# Altium project AutoLidar_VIP_Spring25.PrjPcb (part 1 of 2)
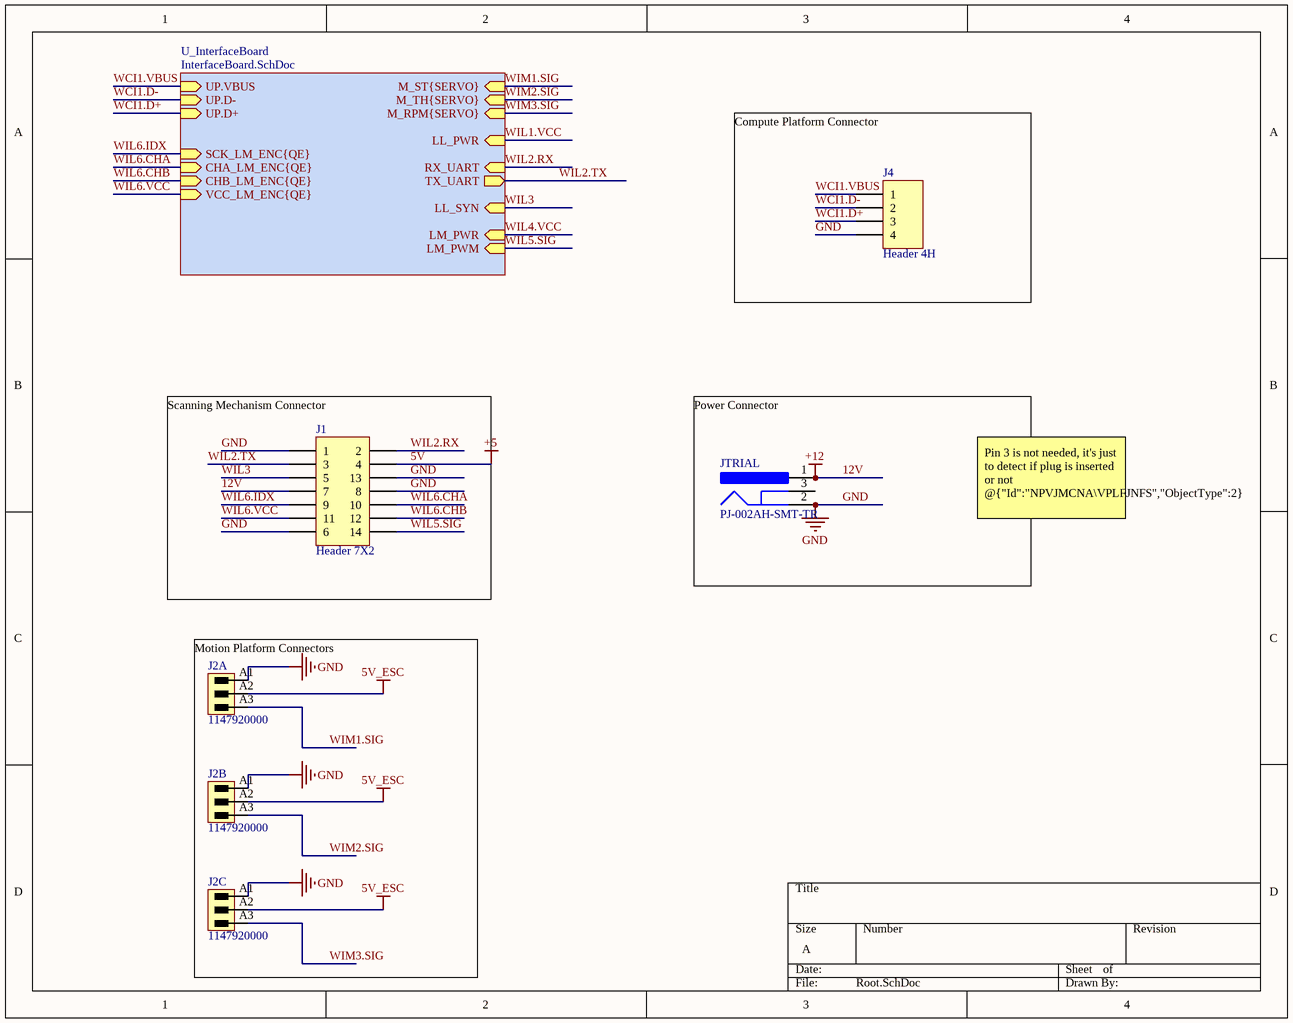
[diagram p0: Root.SchDoc]
11 sheets, 122 parts. Net scope: hierarchical (ports join the sheet entries above them; power ports are global).
Board files: smallerBoardDR1.PcbDoc, PCB1.PcbDoc, draft2.PcbDoc
Sheets:
  Scanning Mechanism.SchDoc
  Power Supply.SchDoc
  Root.SchDoc
    U_InterfaceBoard = InterfaceBoard.SchDoc
      Designator = Manual Override.SchDoc
      Designator = BNO055.SchDoc
      U_5ch Receiver = 5ch Receiver.SchDoc
      U_L Subsys1 = L Subsys1.SchDoc
      U_MSub = MSub.SchDoc
      Designator = USB HUB.SchDoc
      5V Regulator = 5V Regulator.SchDoc

## Sheet Scanning Mechanism.SchDoc
size A; SheetNumber: 6; SheetTotal: 6

## Sheet Power Supply.SchDoc
size A; SheetNumber: 3; SheetTotal: 3

## Sheet Root.SchDoc
size A; SheetNumber: 3; SheetTotal: 11

### Parts
J1  Header 7X2  [HDR2X7]
J2A  1147920000  [SL_5_08HC_180LF_03]
J2B  1147920000  [SL_5_08HC_180LF_03]
J2C  1147920000  [SL_5_08HC_180LF_03]
J4  Header 4H  [HDR1X4H]
JTRIAL  PJ-002AH-SMT-TR  [CUI-PJ-002AH-4_V]

### Sub-sheets
U_InterfaceBoard = InterfaceBoard.SchDoc: M_RPM{SERVO} (in), M_ST{SERVO} (in), M_TH{SERVO} (in), SCK_LM_ENC{QE} (in), CHB_LM_ENC{QE} (in), CHA_LM_ENC{QE} (in), VCC_LM_ENC{QE} (in), LM_PWM (in), RX_UART (in), TX_UART (out), LL_SYN (in), LL_PWR (in), LM_PWR (in), UP.VBUS (in), UP.D+ (in), UP.D- (in)

### Nets
5V: J1.4  [also labelled +5]
5V_ESC: J2A.A2 J2B.A2 J2C.A2
12V: J1.7 JTRIAL.1  [also labelled +12]
GND: J1.1 J1.6 J1.8 J1.13 J2A.A1 J2B.A1 J2C.A1 J4.4 JTRIAL.2
WCI1.D+: J4.3 ; sheet U_InterfaceBoard/UP.D+  [project net UP.D+]
WCI1.D-: J4.2 ; sheet U_InterfaceBoard/UP.D-  [project net UP.D-]
WCI1.VBUS: J4.1 ; sheet U_InterfaceBoard/UP.VBUS  [project net UP.VBUS]
WIL1.VCC: sheet U_InterfaceBoard/LL_PWR
WIL2.RX: J1.2 ; sheet U_InterfaceBoard/RX_UART
WIL2.TX: J1.3 ; sheet U_InterfaceBoard/TX_UART
WIL3: J1.5 ; sheet U_InterfaceBoard/LL_SYN
WIL4.VCC: sheet U_InterfaceBoard/LM_PWR
WIL5.SIG: J1.14 ; sheet U_InterfaceBoard/LM_PWM
WIL6.CHA: J1.10 ; sheet U_InterfaceBoard/CHA_LM_ENC{QE}
WIL6.CHB: J1.12 ; sheet U_InterfaceBoard/CHB_LM_ENC{QE}
WIL6.IDX: J1.9 ; sheet U_InterfaceBoard/SCK_LM_ENC{QE}
WIL6.VCC: J1.11 ; sheet U_InterfaceBoard/VCC_LM_ENC{QE}  [project net DN1.VBUS]
WIM1.SIG: J2A.A3 ; sheet U_InterfaceBoard/M_ST{SERVO}  [project net IM2Y.SIG]
WIM2.SIG: J2B.A3 ; sheet U_InterfaceBoard/M_TH{SERVO}  [project net IM1Y.SIG]
WIM3.SIG: J2C.A3 ; sheet U_InterfaceBoard/M_RPM{SERVO}  [project net DN2.VBUS]

Not connected (* = marked no-connect by the designer): JTRIAL 3

### Notes on the sheet
- (near J4) Compute Platform Connector
- Pin numbering on footprint does not match old design. To minimize confusion we probably should change this at some point @{"Id":"NPVJMCNA\MLTVRLOO","ObjectType":2}
- Pin 3 is not needed, it's just to detect if plug is inserted or not @{"Id":"NPVJMCNA\VPLFJNFS","ObjectType":2}
- (near J1) Scanning Mechanism Connector
- (near JTRIAL) Power Connector
- Motion Platform Connectors

### Library data of the parts
J1 = CMP-002-00362-2: Header, 7-Pin, Dual row; Signal Integrity: Connector; Publisher: Altium Limited; LatestRevisionDate: 17-Jul-2002; LatestRevisionNote: Re-released for DXP Platform.; Component Type: Standard; Source: Miscellaneous Connectors.SchLib; Pins: 14; Design Item ID: Header 7X2
J2A J2B J2C = CMP-1559-01007-1: OMNIMATE Signal - series BL/SL 5.08; Manufacturer: Weidmueller; Contact_surface: tinned; Outgoing_elbow: 180°; Rated_voltage_use_group_B_UL_1059: 300 V; Insulating_material: PA GF; Solder_pin_length_mm: 3.2 mm; Rated_voltage_for_surge_voltage_class_pollution_degree_II_2: 400 V; Side_termination_characteristic: Solder flange; Pitch_mm: 5.08 mm; No_of_poles: 3; Rated_current_use_group_B_UL_1059: 16 A; Short_text_for_material: SL 5.08HC/03/180LF 3.2SN OR BX; Pitch_inch: 0.2 inch; Contact_material: Cu-Leg; UL_94_flammability_rating: V-0; Mounting_onto_the_PCB: Solder connection; Packaging: Box; ComponentLink1URL: http://www.weidmueller.com/; Colour: Orange; PackageReference: SL_5_08HC_180LF_03; Qty: 100 PCS; ComponentLink1Description: Manufacturer URL; Revision: V1; ComponentLink2Description: URL Link1; ComponentLink2URL: http://catalog.weidmueller.com/catalog/Start.do?localeId=en&ObjectID=1147920000; PartNumber: 1147920000
J4 = Header 4H: Header, 4-Pin, Right Angle; LatestRevisionDate: 17-Jul-2002; LatestRevisionNote: Re-released for DXP Platform.; Publisher: Altium Limited
JTRIAL = CMP-2000-06896-2: DC Power Jack, Right Angle, -25 to 85 degC, 4-Pin 14.8 x 9 x 11 mm SMD, RoHS, Tape and Reel; Manufacturer: CUIInc.; Brand: CUI; Inside Contact Diameter: 2mm; Voltage Rating: 24V; Insulation Resistance: 100MOhms; Outside Contact Diameter: 6.5mm; Current Rating: 5A; Mounting Angle: Right; Contact Plating: Nickel; Package Description: 4-Pin Surface Mount Device, Body 14.8 x 9 mm, Pitch 6.1 mm; Factory Pack Quantity: 350; Datasheet Version: Rev. 1.03, 11/2012; Operating Temperature Range: -25Cto+85C; Termination Style: SMD/SMT; Product: Jacks; Contact Gender: Male; Product Category: DCPowerConnectors; RoHS: True; Connector Type: DCPowerJack; Packaging: Reel; Contact Material: Brass; Flammability Rating: UL94V-0; Datasheet URL: http://www.cui.com/product/resource/pj-002ah-smt.pdf; Package Reference: PJ-002AH; Manufacturer URL: http://www.cui.com/; PartNumber: PJ-002AH; Mounting Style: SMD/SMT; Mounting Technology: SurfaceMount; Housing Material: Polyamide(PA)

## Sheet InterfaceBoard.SchDoc
size B; SheetNumber: 4; SheetTotal: 11
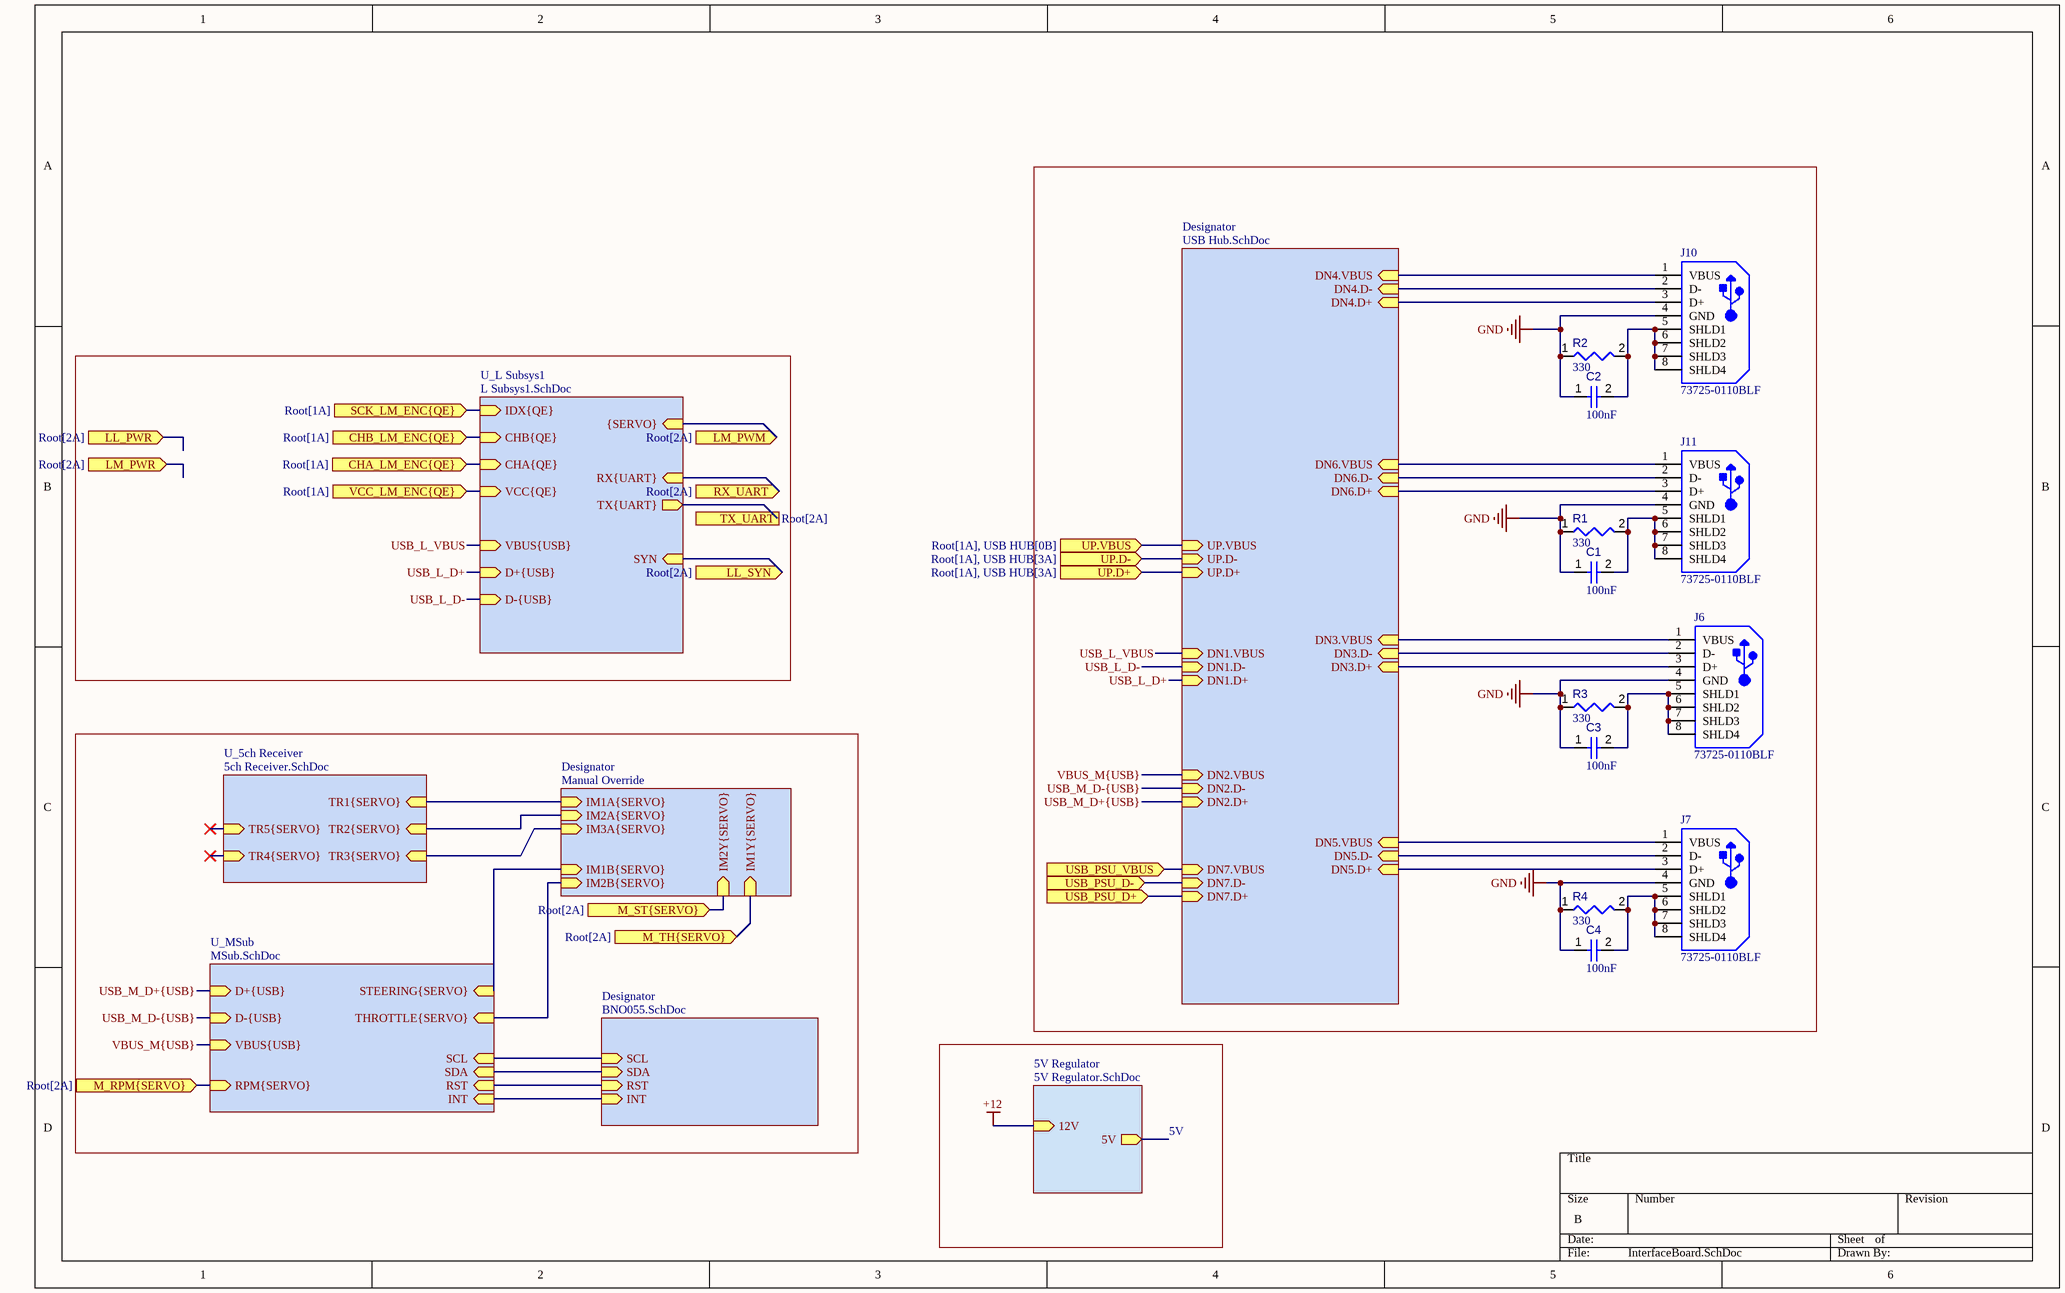
[diagram p1: InterfaceBoard.SchDoc]

### Parts
C1  value 100nF  [CAPC1005X56X25LL10T15]  (hidden comment: Capacitor 0.1 uF +/- 5% 16 V 0402)
C2  value 100nF  [CAPC1005X56X25LL10T15]  (hidden comment: Capacitor 0.1 uF +/- 5% 16 V 0402)
C3  value 100nF  [CAPC1005X56X25LL10T15]  (hidden comment: Capacitor 0.1 uF +/- 5% 16 V 0402)
C4  value 100nF  [CAPC1005X56X25LL10T15]  (hidden comment: Capacitor 0.1 uF +/- 5% 16 V 0402)
J6  73725-0110BLF  [FCI-73725-0110BLF_V]
J7  73725-0110BLF  [FCI-73725-0110BLF_V]
J10  73725-0110BLF  [FCI-73725-0110BLF_V]
J11  73725-0110BLF  [FCI-73725-0110BLF_V]
R1  value 330  [RESC0402(1005)_L]  (hidden comment: Resistor 330R +/-5 % 0402 63 mW)
R2  value 330  [RESC0402(1005)_L]  (hidden comment: Resistor 330R +/-5 % 0402 63 mW)
R3  value 330  [RESC0402(1005)_L]  (hidden comment: Resistor 330R +/-5 % 0402 63 mW)
R4  value 330  [RESC0402(1005)_L]  (hidden comment: Resistor 330R +/-5 % 0402 63 mW)

### Sub-sheets
5V Regulator = 5V Regulator.SchDoc: 12V (in), 5V (out)
Designator = Manual Override: IM1A{SERVO} (in), IM2A{SERVO} (in), IM3A{SERVO} (in), IM1B{SERVO} (in), IM2B{SERVO} (in), IM1Y{SERVO} (in), IM2Y{SERVO} (in)
Designator = BNO055.SchDoc: RST (in), SDA (in), INT (in), SCL (in)
Designator = USB Hub.SchDoc: DN4.VBUS (in), DN4.D- (in), DN4.D+ (in), DN6.VBUS (in), DN6.D- (in), DN6.D+ (in), DN3.VBUS (in), DN3.D- (in), DN3.D+ (in), DN5.VBUS (in), DN5.D- (in), DN5.D+ (in), DN7.D+ (in), DN7.D- (in), DN7.VBUS (in), DN2.D+ (in), DN2.D- (in), DN2.VBUS (in), DN1.D+ (in), DN1.D- (in), DN1.VBUS (in), UP.VBUS (in), UP.D+ (in), UP.D- (in)
U_5ch Receiver = 5ch Receiver.SchDoc: TR2{SERVO} (in), TR5{SERVO} (in), TR3{SERVO} (in), TR1{SERVO} (in), TR4{SERVO} (in)
U_L Subsys1 = L Subsys1.SchDoc: IDX{QE} (in), CHB{QE} (in), CHA{QE} (in), VCC{QE} (in), VBUS{USB} (in), D+{USB} (in), D-{USB} (in), {SERVO} (in), RX{UART} (in), TX{UART} (out), SYN (in)
U_MSub = MSub.SchDoc: D+{USB} (in), RPM{SERVO} (in), STEERING{SERVO} (in), THROTTLE{SERVO} (in), SDA (in), INT (in), RST (in), SCL (in), D-{USB} (in), VBUS{USB} (in)

### Ports
CHA_LM_ENC{QE} (in, see Root[1A]), CHB_LM_ENC{QE} (in, see Root[1A]), LL_PWR (in, see Root[2A]), LL_SYN (in, see Root[2A]), LM_PWM (in, see Root[2A]), LM_PWR (in, see Root[2A]), M_RPM{SERVO} (in, see Root[2A]), M_ST{SERVO} (in, see Root[2A]), M_TH{SERVO} (in, see Root[2A]), RX_UART (in, see Root[2A]), SCK_LM_ENC{QE} (in, see Root[1A]), TX_UART (out, see Root[2A]), UP.D+ (in, see Root[1A], USB HUB[3A]), UP.D- (in, see Root[1A], USB HUB[3A]), UP.VBUS (in, see Root[1A], USB HUB[0B]), USB_PSU_D+ (in), USB_PSU_D- (in), USB_PSU_VBUS (in), VCC_LM_ENC{QE} (in, see Root[1A])

### Nets
GND: C1.1 C2.1 C3.1 C4.1 J6.4(GND) J7.4(GND) J10.4(GND) J11.4(GND) R1.1 R2.1 R3.1 R4.1
DN3.D+: J6.3(D+) ; sheet Designator/DN3.D+
DN3.D-: J6.2(D-) ; sheet Designator/DN3.D-
DN3.VBUS: J6.1(VBUS) ; sheet Designator/DN3.VBUS
DN4.D+: J10.3(D+) ; sheet Designator/DN4.D+
DN4.D-: J10.2(D-) ; sheet Designator/DN4.D-
DN4.VBUS: J10.1(VBUS) ; sheet Designator/DN4.VBUS
DN5.D+: J7.3(D+) ; sheet Designator/DN5.D+
DN5.D-: J7.2(D-) ; sheet Designator/DN5.D-
DN5.VBUS: J7.1(VBUS) ; sheet Designator/DN5.VBUS
DN6.D+: J11.3(D+) ; sheet Designator/DN6.D+
DN6.D-: J11.2(D-) ; sheet Designator/DN6.D-
DN6.VBUS: J11.1(VBUS) ; sheet Designator/DN6.VBUS
DN7.D+: port USB_PSU_D+, sheet Designator/DN7.D+
DN7.D-: port USB_PSU_D-, sheet Designator/DN7.D-
DN7.VBUS: port USB_PSU_VBUS, sheet Designator/DN7.VBUS
IM1A.SIG: sheet Designator/IM1A{SERVO}, sheet U_5ch Receiver/TR1{SERVO}
IM1B.SIG: sheet Designator/IM1B{SERVO}, sheet U_MSub/STEERING{SERVO}
IM1Y.SIG: port M_TH{SERVO}, sheet Designator/IM1Y{SERVO}
IM2A.SIG: sheet Designator/IM2A{SERVO}, sheet U_5ch Receiver/TR2{SERVO}
IM2B.SIG: sheet Designator/IM2B{SERVO}, sheet U_MSub/THROTTLE{SERVO}
IM2Y.SIG: port M_ST{SERVO}, sheet Designator/IM2Y{SERVO}
IM3A.SIG: sheet Designator/IM3A{SERVO}, sheet U_5ch Receiver/TR3{SERVO}
SCL: sheet Designator/SCL, sheet U_MSub/SCL
SDA: sheet Designator/SDA, sheet U_MSub/SDA
UP.D+: port UP.D+, sheet Designator/UP.D+
UP.D-: port UP.D-, sheet Designator/UP.D-
UP.VBUS: port UP.VBUS, sheet Designator/UP.VBUS
USB_L_D+: sheet U_L Subsys1/D+{USB}, sheet Designator/DN1.D+  [project net DN1.D+]
USB_L_D-: sheet U_L Subsys1/D-{USB}, sheet Designator/DN1.D-  [project net DN1.D-]
USB_L_VBUS: port VCC_LM_ENC{QE}, sheet U_L Subsys1/VCC{QE}, sheet U_L Subsys1/VBUS{USB}, sheet Designator/DN1.VBUS  [project net DN1.VBUS]
USB_M_D+{USB}: sheet U_MSub/D+{USB}, sheet Designator/DN2.D+  [project net DN2.D+]
USB_M_D-{USB}: sheet U_MSub/D-{USB}, sheet Designator/DN2.D-  [project net DN2.D-]
VBUS_M{USB}: port M_RPM{SERVO}, sheet U_MSub/RPM{SERVO}, sheet U_MSub/VBUS{USB}, sheet Designator/DN2.VBUS  [project net DN2.VBUS]
WIL2.RX: port RX_UART, sheet U_L Subsys1/RX{UART}
WIL3: port LL_SYN, sheet U_L Subsys1/SYN
WIL5.SIG: port LM_PWM, sheet U_L Subsys1/{SERVO}
WIL6.CHA: port CHA_LM_ENC{QE}, sheet U_L Subsys1/CHA{QE}
WIL6.CHB: port CHB_LM_ENC{QE}, sheet U_L Subsys1/CHB{QE}
WIL6.IDX: port SCK_LM_ENC{QE}, sheet U_L Subsys1/IDX{QE}
NetC1_2: C1.2 J11.5(SHLD1) J11.6(SHLD2) J11.7(SHLD3) J11.8(SHLD4) R1.2
NetC2_2: C2.2 J10.5(SHLD1) J10.6(SHLD2) J10.7(SHLD3) J10.8(SHLD4) R2.2
NetC3_2: C3.2 J6.5(SHLD1) J6.6(SHLD2) J6.7(SHLD3) J6.8(SHLD4) R3.2
NetC4_2: C4.2 J7.5(SHLD1) J7.6(SHLD2) J7.7(SHLD3) J7.8(SHLD4) R4.2
NetU8_6: sheet Designator/RST, sheet U_MSub/RST
NetU8_8: sheet Designator/INT, sheet U_MSub/INT

### Notes on the sheet
- 5V

### Library data of the parts
C1-C4 = CMP-001-00001-6: Chip Capacitor, 0.1 uF, +/- 5%, 16 V, 0402 (1005 Metric); Capacitor Type: Ceramic; Voltage Rating: 16V; Max Operating Temperature: 125°C; Min Operating Temperature: -55°C; Case/Package: 0402; Mounting Technology: SM; Pins: 2; Tolerance: 5%; RoHS Compliant: True
J6 J7 J10 J11 = CMP-2000-05674-1: USB-A 2.0 Receptacle Connector, RA, -40 to 85 degC, 4-Pin THD, RoHS, Tube; Number of Contacts: 4; Brand: FCI; Number of Ports: 1; Gender: Female; Connector Type: USBTypeAReceptacle,Upright; Mounting Angle: Right; Datasheet Version: Rev. AH, 09/2015; RoHS: Details; Shell Plating: Tin; Packaging: Tube; Mounting Style: ThroughHole; Standard: USB2.0; Features: Singlestack,nobackshield,withoutsensorcontact; Factory Pack Quantity: 30; Package Reference: 73725-0110BLF; Flammability Rating: UL94V-0; Product: USBTypeAConnectors; Series: USB; Number of Positions / Contacts: 4; Manufacturer: FCI; Contact Material: CopperAlloy; Datasheet URL: http://portal.fciconnect.com/Comergent//fci/drawing/73725.pdf; Product Category: USBConnectors; Mounting Technology: ThroughHole; Termination Style: SolderPin; Package Description: 4-Pin Throug Hole Device, Body 19.7 x 5.76 mm, Pitch 2 mm; Manufacturer URL: http://portal.fciconnect.com/; Color: White; Contact Plating: PalladiumNickelAlloy(GXT); Number of Positions: 4
R1-R4 = CMP-009-00132-3: Chip Resistor, 330 Ohms, +/-5 %, 63 mW, -55 to 155 degC, 0402; Power: 63mW; Tolerance: 5%; Pins: 2; Max Operating Temperature: 155°C; Min Operating Temperature: -55°C; Case/Package: 0402

## Sheet Manual Override.SchDoc
size A; SheetNumber: 8; SheetTotal: 11
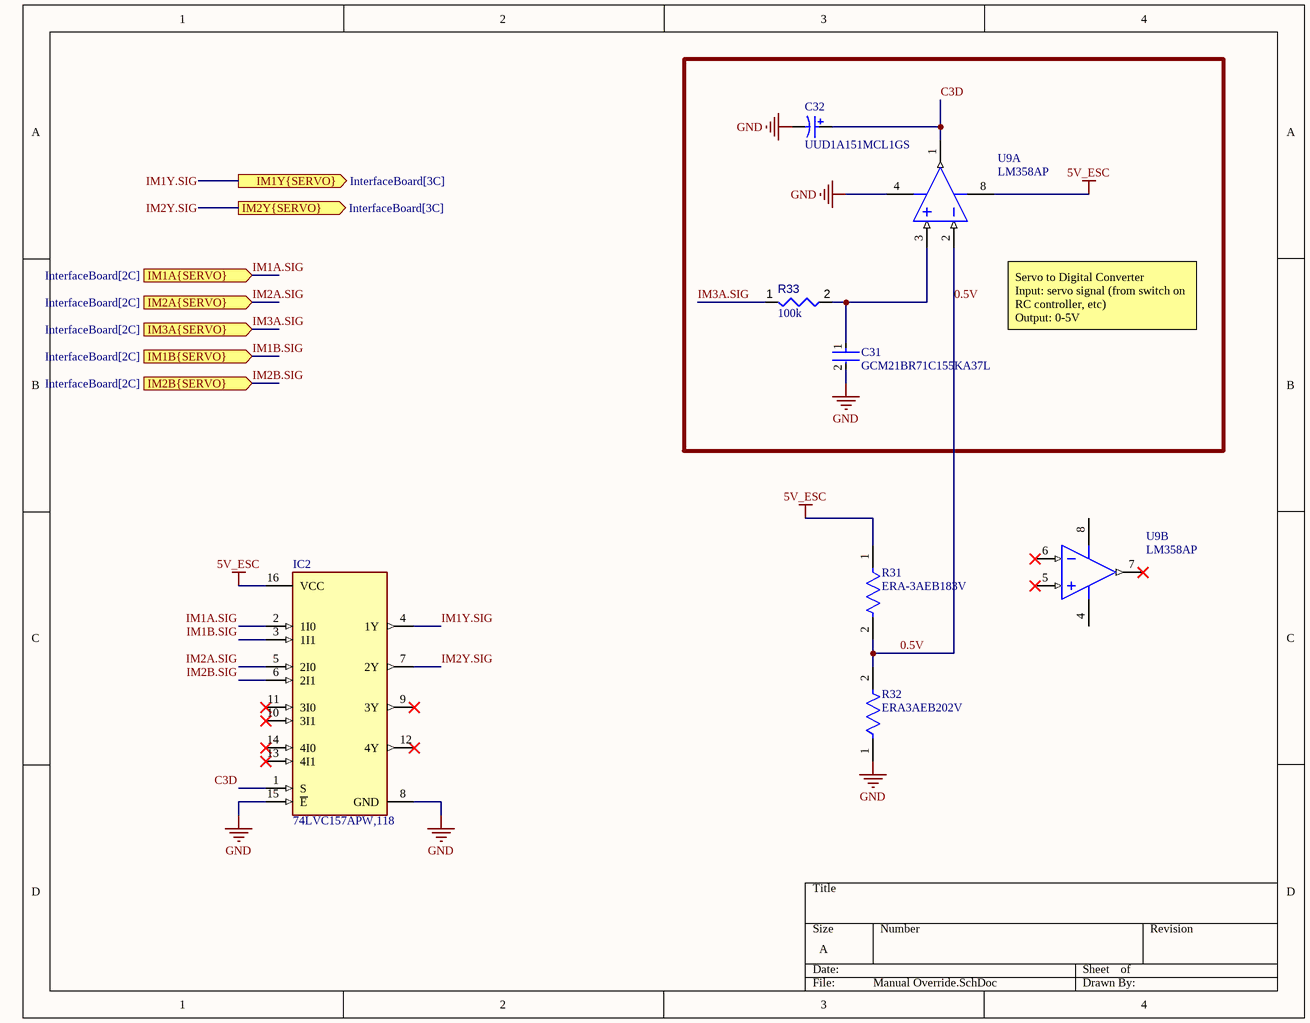
[diagram p2: Manual Override.SchDoc]

### Parts
C31  GCM21BR71C155KA37L  [FP-GCM21B-0_15-IPC_B]
C32  UUD1A151MCL1GS  [NIC-CAPA2-6.3X5.8_V]
IC2  74LVC157APW,118  [FP-SOT403-1-IPC_B]
R31  ERA-3AEB183V  [FP-ERA3A-IPC_A]
R32  ERA3AEB202V  [FP-ERA3A-IPC_C]
R33  value 100k  [RESC1608X55X25ML10T15]  (hidden comment: Resistor 100k +/-1% 0603 100 mW)
U9  LM358AP  [P0008A]  (parts A,B of 2)

### Ports
IM1A{SERVO} (in, see InterfaceBoard[2C]), IM1B{SERVO} (in, see InterfaceBoard[2C]), IM1Y{SERVO} (out, see InterfaceBoard[3C]), IM2A{SERVO} (in, see InterfaceBoard[2C]), IM2B{SERVO} (in, see InterfaceBoard[2C]), IM2Y{SERVO} (out, see InterfaceBoard[3C]), IM3A{SERVO} (in, see InterfaceBoard[2C])

### Nets
5V_ESC: IC2.16(VCC) R31.1 U9.8(VCC)
GND: C31.2 C32.2 IC2.8(GND) IC2.15(~{E}) R32.1 U9.4(GND)
0.5V: R31.2 R32.2 U9.2(1IN-)
C3D: C32.1 IC2.1(S) U9.1(1OUT)
IM1A.SIG: IC2.2(1I0) ; port IM1A{SERVO}
IM1B.SIG: IC2.3(1I1) ; port IM1B{SERVO}
IM1Y.SIG: IC2.4(1Y) ; port IM1Y{SERVO}
IM2A.SIG: IC2.5(2I0) ; port IM2A{SERVO}
IM2B.SIG: IC2.6(2I1) ; port IM2B{SERVO}
IM2Y.SIG: IC2.7(2Y) ; port IM2Y{SERVO}
IM3A.SIG: R33.1 ; port IM3A{SERVO}
NetC31_1: C31.1 R33.2 U9.3(1IN+)

Not connected (* = marked no-connect by the designer): IC2 9(3Y)* 10(3I1)* 11(3I0)* 12(4Y)* 13(4I1)* 14(4I0)*; U9 5(2IN+)* 6(2IN-)* 7(2OUT)*

### Notes on the sheet
- Servo to Digital Converter
  Input: servo signal (from switch on RC controller, etc)
  Output: 0-5V
  The DPDT DIP switch (76SD01T) allows for changing the polarity

### Library data of the parts
C31 = CMP-2007-03337-2: Ceramic Capacitor for Automotive 1.5uF ±10% 16VDC X7R 0805 Embossed T/R; Voltage Rating: 16V; Case Code (Metric): 2012; Length: 2mm; Package Quantity: 3000; Width: 0.049inch; Min Operating Temperature: -55°C; Depth: 1.25mm; Capacitance: 1.5uF; Radiation Hardening: No; Packaging: Tape and Reel; Max Operating Temperature: 125°C; Ratings: AEC-Q200; Case Code (Imperial): 0805; Dielectric: X7R; Mount: Surface Mount; Tolerance: 10%; Thickness: 0.055inch; Height: 1.25mm; Case/Package: 0805; Voltage Rating (DC): 16V; Termination: SMD/SMT
C32 = CMP-0687-00052-1: Aluminum Electrolytic Capacitor, UD Series, Low Impedance, 150 uF, 10 V, + / - 20%, -55 to 105 degC, Chip Type, 6.3 x 5.8 mm D x L, Pb-Free, Reel; Manufacturer: Nichicon; Tolerance Rated Capacitance: -20 to 20%; Endurance Time: 2000 h; Rated Voltage: 10 V; Impedance: 0.44 Ohm; Rated Capacitance: 150 uF; Rated Ripple Current (at 100kHz): 230 mA; Packing: Dia382mm Reel; RoHS: TRUE; ComponentLink1URL: http://www.nichicon.co.jp/; Mounting Technology: Surface Mount; Length: 5.8 mm; ComponentLink3URL: http://products.nichicon.co.jp/en/pdf/XJA043/e-ud.pdf; ComponentLink1Description: Manufacturer URL; ComponentLink2URL: http://products.nichicon.co.jp/en/pdf/XJA043/e-ud.pdf; DatasheetVersion: 08/2012; ComponentLink3Description: Package Specification; ComponentLink2Description: Datasheet; PartNumber: UUD1A151MCL1GS; Diameter: 6.3 mm; PackageDescription: 2-Pin Surface Mount Device, Diameter 6.3 mm, Height 5.8 mm, Pitch 5.4 mm; PackageReference: CAPAE-D6.3H5.8
IC2 = CMP-14348-000002-1: IC QUAD 2-IN MUX 16-TSSOP
R31 = CMP-2000-00938-2: RES SMD 18K OHM 0.1% 1/10W 0603; Power Rating: 100mW; Voltage Rating: 75V; Temperature Coefficient: 25ppm/°C; Resistance: 18kR; Military Standard: Not; Resistance Tolerance: 0.1%; Width: 0.8mm; Number of Terminations: 2; Max Operating Temperature: 155°C; Length: 1.6mm; REACH SVHC: No SVHC; Technology: METAL FILM; Min Operating Temperature: -55°C; Case/Package: 0603; Size Code: 0603; Lead Free: Lead Free; Number of Pins: 2; Features: Automotive AEC-Q200; Series: ERA-3A; Resistor Type: Thin Film; Contact Plating: Tin; Case Code (Metric): 1608; Termination: SMD/SMT; Mount: Surface Mount; Height: 0.45mm; Tolerance: 0.1%; Max Power Dissipation: 100mW; Case Code (Imperial): 0603; Depth: 0.8mm; Construction: Rectangular; Package Quantity: 1; Packaging: Tape and Reel; RoHS Compliant: Yes; Voltage Rating (DC): 75V; Radiation Hardening: No
R32 = CMP-2000-00945-2: RES SMD 2K OHM 0.1% 1/10W 0603; Resistance: 2kR; Max Power Dissipation: 100mW; Voltage Rating (DC): 75V; Temperature Coefficient: 25ppm/°C; REACH SVHC: No SVHC; Number of Terminations: 2; RoHS Compliant: Yes; Case Code (Metric): 1608; Package Quantity: 5000; Width: 0.8mm; Mount: Surface Mount; Series: ERA-3A; Number of Pins: 2; Height: 0.45mm; Military Standard: Not; Packaging: Tape and Reel; Resistor Type: Thin Film; Lead Free: Lead Free; Construction: Rectangular; Max Operating Temperature: 155°C; Contact Plating: Tin; Termination: SMD/SMT; Technology: THIN FILM; Length: 1.6mm; Power Rating: 100mW; Resistance Tolerance: 0.1%; Working Voltage: 75V; Voltage Rating: 75V; Depth: 0.8mm; Case Code (Imperial): 0603; Radiation Hardening: No; Case/Package: 0603; Tolerance: 0.1%; Min Operating Temperature: -55°C
R33 = CMP-009-00023-5: Chip Resistor, 100 KOhm, +/- 1%, 0.1 W, -55 to 155 degC, 0603 (1608 Metric); Voltage Rating: 50V; Power: 100mW; Max Operating Temperature: 155°C; RoHS Compliant: True; Tolerance: 1%; Pins: 2; Case/Package: 0603; Mounting Technology: SM; Min Operating Temperature: -55°C
U9 = CMP-1685-00017-1: Dual Operational Amplifier, 3 to 32 V, 0 to 70 degC, 8-Pin PDIP (P), Pb-Free (RoHS), Tube; Case\Package: 0603; Luminous Intensity: 90 mcd; Viewing Angle: 130 degrees; Nominal Vf: 2 V; Lens Style: Diffused; Illumination Colour: Orange; Power Rating: 75 mW; Forward Current: 20 mA; Pins: 2; ComponentLink3Description: Package Specification; Packaging: Tape and Reel; Mount: Surface Mount; PackageReference: P0008A; Radiation Hardening: No; ComponentLink3URL: http://www.ti.com/lit/ml/mpdi001b/mpdi001b.pdf; Case Code (Metric): 1608; ComponentLink2Description: Datasheet; Max Operating Temperature: 85 degC; ComponentLink1Description: Manufacturer URL; RoHSCompliant: true; Width: 0.8 mm; Length: 1.6 mm; DatasheetVersion: SLOS068T, 04/2015; Min Operating Temperature: -55 degC; Height: 1.1 mm; Colour: Orange; ComponentLink2URL: http://www.ti.com/lit/ds/symlink/lm358a.pdf; PackageDescription: 8-Pin Double In-line Package, Body 9.59 x 6.35 mm, Pitch 2.54 mm; PackageVersion: 4040082/E, 04/2010; Forward Voltage: 2 V; Package Quantity: 3000; Case Code (Imperial): 0603; ComponentLink1URL: http://www.ti.com/

## Sheet BNO055.SchDoc
size 297 x 209 mm; SheetNumber: 5; SheetTotal: 11
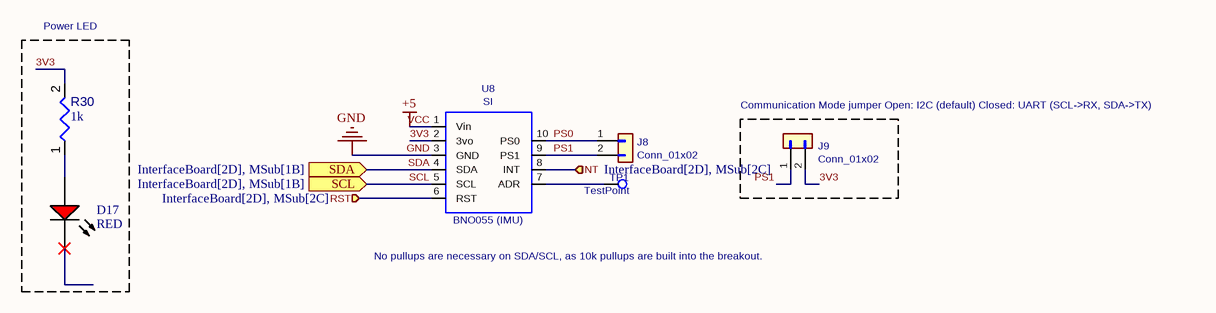
[diagram p3: BNO055.SchDoc]

### Parts
D17  RED  [LTST-C191KRKT_V]
J8  Conn_01x02  [HDR1X2]
J9  Conn_01x02  [HDR1X2]
R30  value 1k  [RESC1608X55X25ML10T15]  (hidden comment: Resistor 1k +/-1% 0603 100 mW)
TP1  TestPoint  [Test Point]
U8  SI  [BNO055 Adafruit Breakout]

### Blocks framed on the sheet
Power LED: D17 R30

### Ports
INT (in, see InterfaceBoard[2D], MSub[2C]), RST (in, see InterfaceBoard[2D], MSub[2C]), SCL (in, see InterfaceBoard[2D], MSub[1B]), SDA (in, see InterfaceBoard[2D], MSub[1B])

### Nets
+5: U8.1(Vin)  [also labelled VCC]  [project net 5V]
GND: U8.3(GND)
3V3: J9.2(Pin_2) R30.2 U8.2(3vo)
PS0: J8.1(Pin_1) U8.10(PS0)
PS1: J8.2(Pin_2) J9.1(Pin_1) U8.9(PS1)
SCL: U8.5(SCL) ; port SCL
SDA: U8.4(SDA) ; port SDA
NetD17_1: D17.1(A) R30.1
NetTP1_1: TP1.1 U8.7(ADR)
NetU8_6: U8.6(RST) ; port RST
NetU8_8: U8.8(INT) ; port INT

Not connected (* = marked no-connect by the designer): D17 2(K)*

### Notes on the sheet
- (near J9) Communication Mode jumper
  Open: I2C (default)
  Closed: UART (SCL->RX, SDA->TX)
- No pullups are necessary on SDA/SCL,
  as 10k pullups are built into the breakout.
- 1
- 2
- 3
- 4
- 5
- 6
- A
- B
- C
- D
- Title:
- File: BNO055.kicad_sch
- Sheet: /
- KiCad E.D.A.  kicad (5.1.4)-1
- Size: A4
- Date:
- Rev:
- Id: 1/1
- (in symbol SI) BNO055 (IMU)

### Library data of the parts
D17 = CMP-007-00024-2: LED Uni-Color Red, 62.5 mW, 25 mA, -30 to 85 degC, 2-Pin SMD, RoHS, Tape and Reel; Manufacturer: Lite-On; Power: 75mW; Forward Voltage: 2V; Luminous Intensity: 54mcd; Lens Style: Diffused; Viewing Angle: 130degrees; Forward Current: 20mA; Manufacturer URL: http://www.us.liteon.com/; Case/Package: 0603; Datasheet Version: Rev. F, 05/2013; Package Reference: C191KRKT; Datasheet URL: http://optoelectronics.liteon.com/upload/download/DS-22-99-0151/S_110_LTST-C190KRKT.pdf; Package Description: 2-Pin Surface Mount Device, Body 1.6 x 0.8 mm; Nominal Vf: 2V; Packaging: TapeandReel; RoHS Compliant: True; Pins: 2; Illumination Colour: Red; Colour: Red; Mounting Technology: SM; Package Quantity: 3000; Min Operating Temperature: -55°C; Max Operating Temperature: 85°C
R30 = CMP-009-00014-5: Chip Resistor, 1 KOhm, +/-1%, 0.1 W, -55 to 155 degC, 0603 (1608 Metric); Voltage Rating: 50V; Power: 100mW; Tolerance: 1%; Mounting Technology: SM; Pins: 2; Case/Package: 0603; Min Operating Temperature: -55°C; RoHS Compliant: True; Max Operating Temperature: 155°C
J8 J9 = Conn_01x02: Value: Conn_01x02; Footprint: Connector_PinHeader_2.54mm:PinHeader_1x02_P2.54mm_Vertical
TP1 = TestPoint: Value: TestPoint; Footprint: TestPoint:TestPoint_Plated_Hole_D2.0mm
U8 = SI: Value: SI; Footprint: Sprite:SI

## Sheet 5ch Receiver.SchDoc
size 297 x 209 mm; SheetNumber: 6; SheetTotal: 11
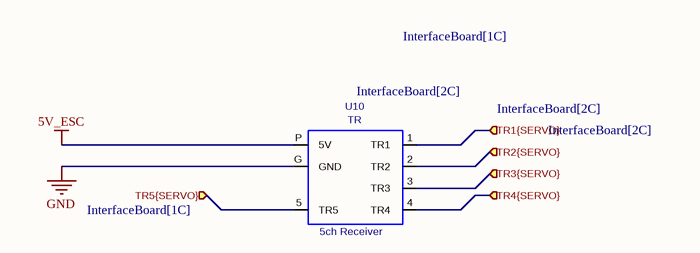
[diagram p4: 5ch Receiver.SchDoc]

### Parts
U10  TR  [5Ch_Reciever]

### Ports
TR1{SERVO} (in, see InterfaceBoard[2C]), TR2{SERVO} (in, see InterfaceBoard[2C]), TR3{SERVO} (in, see InterfaceBoard[2C]), TR4{SERVO} (in, see InterfaceBoard[1C]), TR5{SERVO} (in, see InterfaceBoard[1C])

### Nets
5V_ESC: U10.P(5V)
GND: U10.G(GND)
IM1A.SIG: U10.1(TR1) ; port TR1{SERVO}
IM2A.SIG: U10.2(TR2) ; port TR2{SERVO}
IM3A.SIG: U10.3(TR3) ; port TR3{SERVO}
NetU10_4: U10.4(TR4) ; port TR4{SERVO}
NetU10_5: U10.5(TR5) ; port TR5{SERVO}

### Notes on the sheet
- 1
- 2
- 3
- 4
- 5
- 6
- A
- B
- C
- D
- Title:
- File: Receiver.kicad_sch
- Sheet: /
- KiCad E.D.A.  kicad (5.1.4)-1
- Size: A4
- Date:
- Rev:
- Id: 1/1
- (in symbol TR) 5ch Receiver

### Library data of the parts
U10 = TR: Value: TR; Footprint: Sprite:TR

## Sheet L Subsys1.SchDoc
size A; SheetNumber: 9; SheetTotal: 11
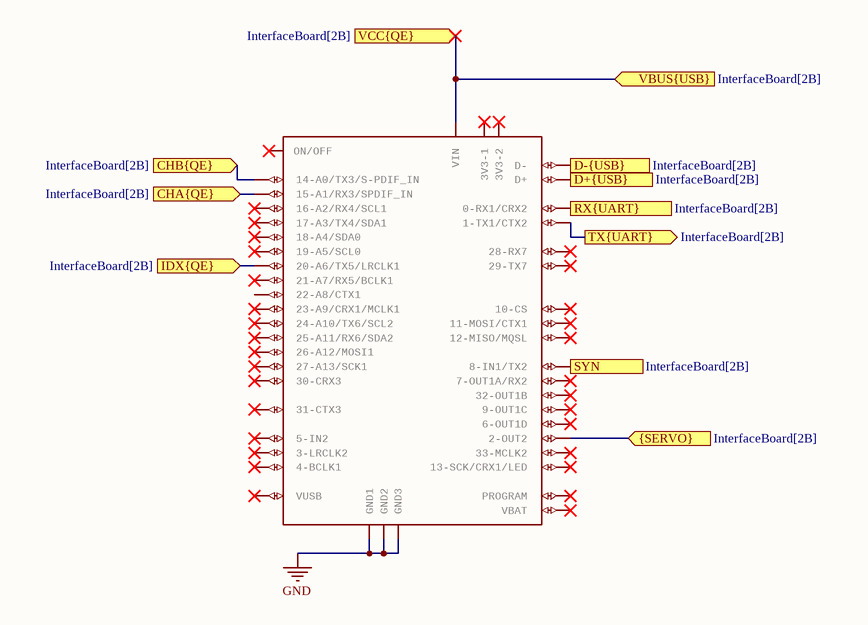
[diagram p5: L Subsys1.SchDoc]

### Parts
UL  DEV-16771  [TEENSY40]  (value not drawn)

### Ports
CHA{QE} (in, see InterfaceBoard[2B]), CHB{QE} (in, see InterfaceBoard[2B]), D+{USB} (in, see InterfaceBoard[2B]), D-{USB} (in, see InterfaceBoard[2B]), IDX{QE} (in, see InterfaceBoard[2B]), RX{UART} (in, see InterfaceBoard[2B]), SYN (in, see InterfaceBoard[2B]), TX{UART} (out, see InterfaceBoard[2B]), VBUS{USB} (in, see InterfaceBoard[2B]), VCC{QE} (in, see InterfaceBoard[2B]), {SERVO} (in, see InterfaceBoard[2B])

### Nets
GND: UL.GND1 UL.GND2 UL.GND3
DN1.D+: UL.D+ ; port D+{USB}
DN1.D-: UL.D- ; port D-{USB}
DN1.VBUS: UL.VIN ; port VBUS{USB}, port VCC{QE}
WIL2.RX: UL.0-RX1(0-RX1/CRX2) ; port RX{UART}
WIL3: UL.8-TX2/IN1(8-IN1/TX2) ; port SYN
WIL5.SIG: UL.2-OUT2 ; port {SERVO}
WIL6.CHA: UL.15-A1/RX3/S-PDIF_IN(15-A1/RX3/SPDIF_IN) ; port CHA{QE}
WIL6.CHB: UL.14-A0/TX3/S-PFI_OUT(14-A0/TX3/S-PDIF_IN) ; port CHB{QE}
WIL6.IDX: UL.20-A6/TX5/LRCLK1 ; port IDX{QE}
NetUL_1-TX1: UL.1-TX1(1-TX1/CTX2) ; port TX{UART}

Not connected (* = marked no-connect by the designer): UL 3-LRCLK2* 3V3-1* 3V3-2* 4-BCLK2(4-BCLK1)* 5-IN2* 6-OUT1D* 7-RX2/OUT1A(7-OUT1A/RX2)* 9-OUT1C* 10-CS/MQSR(10-CS)* 11-MOSI/CTX1* 12-MIO/MQSL(12-MISO/MQSL)* 13-SCK/CRX1/LED* 16-A2/RX4/SCL1* 17-A3/TX4/SDA1* 18-A4/SDA0* 19-A5/SCL0* 21-A7/RX5/BCLK1* 22-A8/CTX1 23-A9/CRX1/CCLK1(23-A9/CRX1/MCLK1)* 24-A10/TX6/SCL2* 25-A11/SDA2(25-A11/RX6/SDA2)* 26-A12/MOSI1* 27-A13/SCK1* 28-RX7* 29-TX7* 30-CRX3* 31-CTX3* 32-OUTB1(32-OUT1B)* 33-MCLK2* ON/OFF* PROGRAM* VBAT* VUSB*

### Library data of the parts
UL = TEENSY40: GateName_1: G$1; SymbolName_1: TEENSY40; LibraryName: TEENSYV1; DeviceSetName: TEENSY40; Package: TEENSY40

## Sheet MSub.SchDoc
size B; SheetNumber: 10; SheetTotal: 11
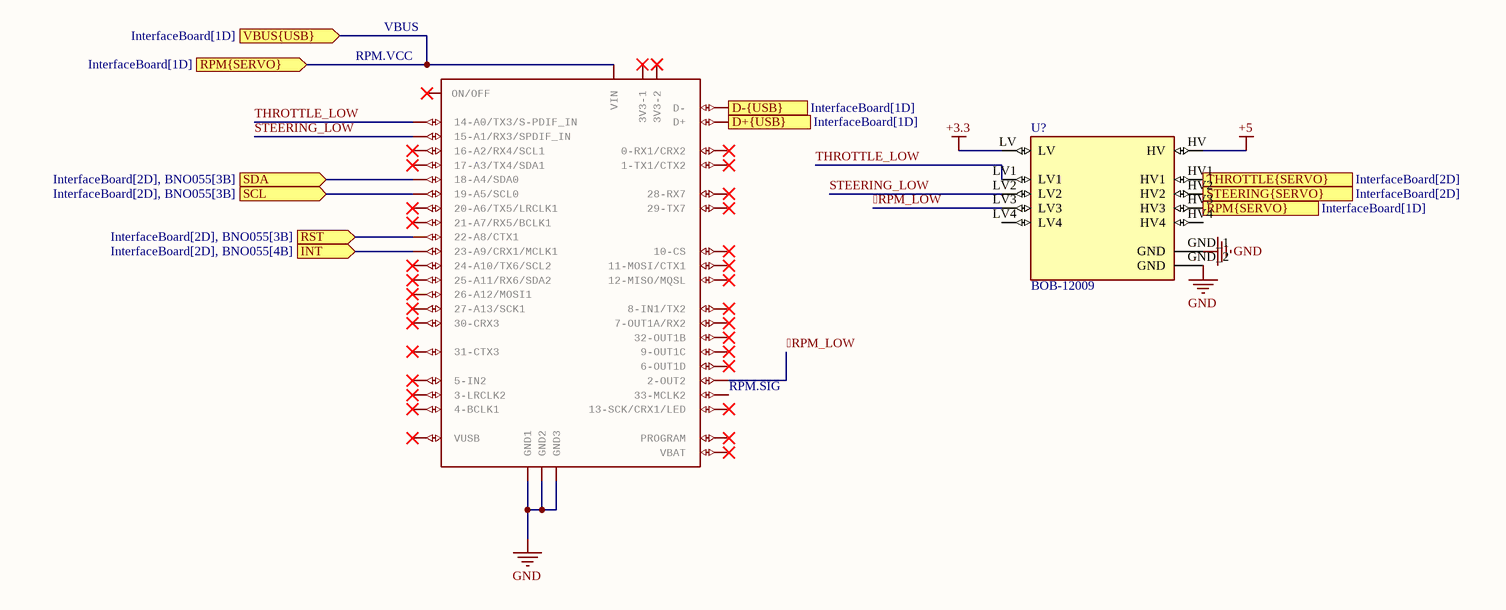
[diagram p6: MSub.SchDoc]

### Parts
U?  BOB-12009  [CONV_BOB-12009]
UM  Teensy 4.0 device including POGO pins for pins 24 - 33, but not yet pins for D+ and D-.  Symbol layout is what works for me and may not suite everyone... that can be added or additional symbols can be created to be used in a modilied davie name.  [TEENSY40]  (value not drawn)

### Ports
D+{USB} (in, see InterfaceBoard[1D]), D-{USB} (in, see InterfaceBoard[1D]), INT (in, see InterfaceBoard[2D], BNO055[4B]), RPM{SERVO} (in, see InterfaceBoard[1D]), RST (in, see InterfaceBoard[2D], BNO055[3B]), SCL (in, see InterfaceBoard[2D], BNO055[3B]), SDA (in, see InterfaceBoard[2D], BNO055[3B]), STEERING{SERVO} (in, see InterfaceBoard[2D]), THROTTLE{SERVO} (in, see InterfaceBoard[2D]), VBUS{USB} (in, see InterfaceBoard[1D])

### Nets
+3.3: U?.LV
+5: U?.HV  [project net 5V]
GND: U?.GND_1(GND) U?.GND_2(GND) UM.GND1 UM.GND2 UM.GND3
RPM_LOW: U?.LV3 UM.2-OUT2
DN2.D+: UM.D+ ; port D+{USB}
DN2.D-: UM.D- ; port D-{USB}
DN2.VBUS: U?.HV3 UM.VIN ; port VBUS{USB}, port RPM{SERVO}
IM1B.SIG: U?.HV2 ; port STEERING{SERVO}
IM2B.SIG: U?.HV1 ; port THROTTLE{SERVO}
SCL: UM.19-A5/SCL0 ; port SCL
SDA: UM.18-A4/SDA0 ; port SDA
STEERING_LOW: U?.LV2 UM.15-A1/RX3/S-PDIF_IN(15-A1/RX3/SPDIF_IN)
THROTTLE_LOW: U?.LV1 UM.14-A0/TX3/S-PFI_OUT(14-A0/TX3/S-PDIF_IN)
NetU8_6: UM.22-A8/CTX1 ; port RST
NetU8_8: UM.23-A9/CRX1/CCLK1(23-A9/CRX1/MCLK1) ; port INT

Not connected (* = marked no-connect by the designer): U? HV4 LV4; UM 0-RX1(0-RX1/CRX2)* 1-TX1(1-TX1/CTX2)* 3-LRCLK2* 3V3-1* 3V3-2* 4-BCLK2(4-BCLK1)* 5-IN2* 6-OUT1D* 7-RX2/OUT1A(7-OUT1A/RX2)* 8-TX2/IN1(8-IN1/TX2)* 9-OUT1C* 10-CS/MQSR(10-CS)* 11-MOSI/CTX1* 12-MIO/MQSL(12-MISO/MQSL)* 13-SCK/CRX1/LED* 16-A2/RX4/SCL1* 17-A3/TX4/SDA1* 20-A6/TX5/LRCLK1* 21-A7/RX5/BCLK1* 24-A10/TX6/SCL2* 25-A11/SDA2(25-A11/RX6/SDA2)* 26-A12/MOSI1* 27-A13/SCK1* 28-RX7* 29-TX7* 30-CRX3* 31-CTX3* 32-OUTB1(32-OUT1B)* 33-MCLK2 ON/OFF* PROGRAM* VBAT* VUSB*

### Notes on the sheet
- (near UM) RPM.VCC
- (near UM) VBUS
- (near UM) RPM.SIG

### Library data of the parts
U? = CMP-030-000000-1: BSS138 - Logic-Level Translator Interface Evaluation Board; MF: SparkFun; SnapEDA_Link: https://www.snapeda.com/parts/BOB-12009/SparkFun/view-part/?ref=snap; Component Type: Standard; Source: BOB-12009.SchLib; Pin Count: 12; Check_prices: https://www.snapeda.com/parts/BOB-12009/SparkFun/view-part/?ref=eda; Value: *; MP: BOB-12009; Design Item ID: BOB-12009; Package: None
UM = TEENSY40: GateName_1: G$1; SymbolName_1: TEENSY40; LibraryName: TEENSYV1; DeviceSetName: TEENSY40; Package: TEENSY40

## Sheet USB HUB.SchDoc
size A3; SheetNumber: 7; SheetTotal: 11
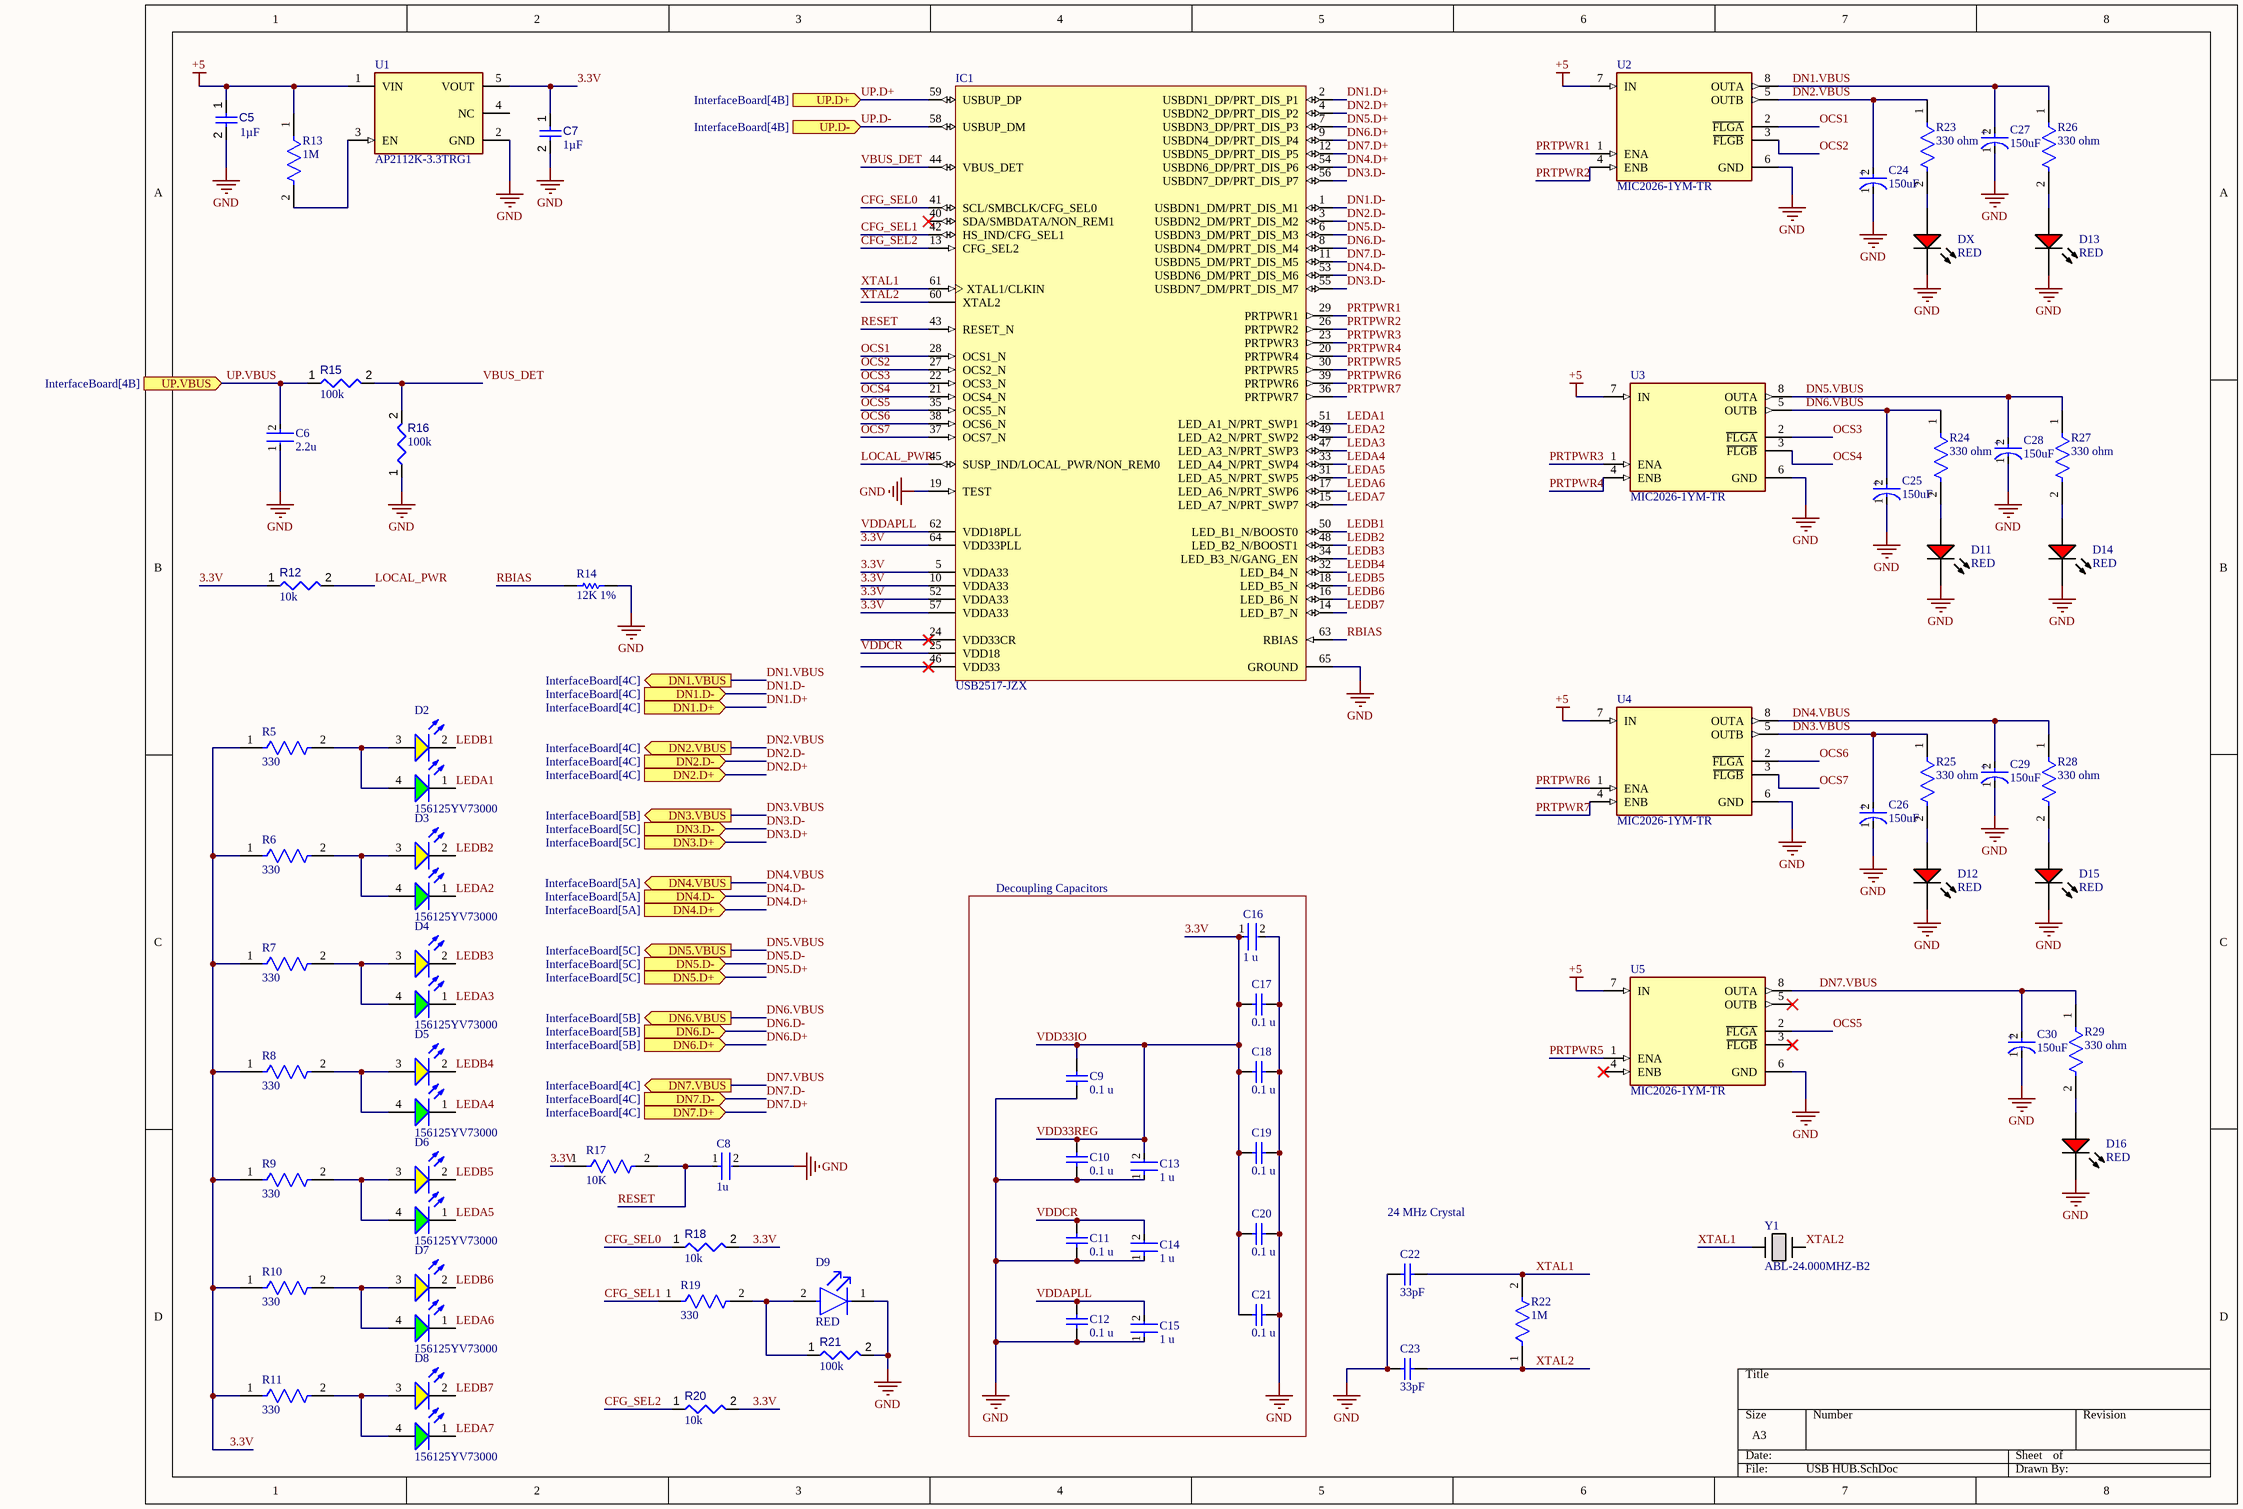
[diagram p7: USB HUB.SchDoc]

### Parts
C5  value 1µF  [CAPC1608X94X35NL15T15]  (hidden comment: Capacitor 1 uF +/- 10% 16 V 0603)
C6  2.2u  [FP-C1608-080-0_1-MFG]
C7  value 1µF  [CAPC1608X94X35NL15T15]  (hidden comment: Capacitor 1 uF +/- 10% 16 V 0603)
C8  1u  [FP-0603-L_1_6_0_15-W_0_81-IPC_A]
C9  0.1 u  [CAPC1608X90X35LL15T15]
C10  0.1 u  [CAPC1608X90X35LL15T15]
C11  0.1 u  [CAPC1608X90X35LL15T15]
C12  0.1 u  [CAPC1608X90X35LL15T15]
C13  1 u  [FP-0603-L_1_6_0_15-W_0_8-IPC_C]
C14  1 u  [FP-0603-L_1_6_0_15-W_0_8-IPC_C]
C15  1 u  [FP-0603-L_1_6_0_15-W_0_8-IPC_C]
C16  1 u  [FP-0603-L_1_6_0_15-W_0_8-IPC_C]
C17  0.1 u  [CAPC1608X90X35LL15T15]
C18  0.1 u  [CAPC1608X90X35LL15T15]
C19  0.1 u  [CAPC1608X90X35LL15T15]
C20  0.1 u  [CAPC1608X90X35LL15T15]
C21  0.1 u  [CAPC1608X90X35LL15T15]
C22  33pF  [WCAP-CSGP_0603_L1.6W0.8H0.8_Reflow]
C23  33pF  [WCAP-CSGP_0603_L1.6W0.8H0.8_Reflow]
C24  150uF  [FP-OS-CON-SMT-B6-MFG]
C25  150uF  [FP-OS-CON-SMT-B6-MFG]
C26  150uF  [FP-OS-CON-SMT-B6-MFG]
C27  150uF  [FP-OS-CON-SMT-B6-MFG]
C28  150uF  [FP-OS-CON-SMT-B6-MFG]
C29  150uF  [FP-OS-CON-SMT-B6-MFG]
C30  150uF  [FP-OS-CON-SMT-B6-MFG]
D2  156125YV73000  [WL-SBRW_1205_reverse mount]
D3  156125YV73000  [WL-SBRW_1205_reverse mount]
D4  156125YV73000  [WL-SBRW_1205_reverse mount]
D5  156125YV73000  [WL-SBRW_1205_reverse mount]
D6  156125YV73000  [WL-SBRW_1205_reverse mount]
D7  156125YV73000  [WL-SBRW_1205_reverse mount]
D8  156125YV73000  [WL-SBRW_1205_reverse mount]
D9  RED  [FP-SML-LX0603SIW-TR-MFG]
D11  RED  [LTST-C191KRKT_V]
D12  RED  [LTST-C191KRKT_V]
D13  RED  [LTST-C191KRKT_V]
D14  RED  [LTST-C191KRKT_V]
D15  RED  [LTST-C191KRKT_V]
D16  RED  [LTST-C191KRKT_V]
DX  RED  [LTST-C191KRKT_V]
IC1  USB2517-JZX  [MCHP-QFN-64-4700X4700TP_L]
R5  330  [FP-CRGCQ0603-IPC_C]
R6  330  [FP-CRGCQ0603-IPC_C]
R7  330  [FP-CRGCQ0603-IPC_C]
R8  330  [FP-CRGCQ0603-IPC_C]
R9  330  [FP-CRGCQ0603-IPC_C]
R10  330  [FP-CRGCQ0603-IPC_C]
R11  330  [FP-CRGCQ0603-IPC_C]
R12  value 10k  [RESC1608X55X25ML10T15]  (hidden comment: Resistor 10k +/-1% 0603 100 mW)
R13  1M  [FP-AC0603-IPC_A]
R14  12K 1%  [RESC1608X55X25LL10T15]
R15  value 100k  [RESC1608X55X25ML10T15]  (hidden comment: Resistor 100k +/-1% 0603 100 mW)
R16  value 100k  [RESC1608X55X25ML10T15]  (hidden comment: Resistor 100k +/-1% 0603 100 mW)
R17  10K  [FP-CRGCQ0603-IPC_C]
R18  value 10k  [RESC1608X55X25ML10T15]  (hidden comment: Resistor 10k +/-1% 0603 100 mW)
R19  330  [FP-CRGCQ0603-IPC_C]
R20  value 10k  [RESC1608X55X25ML10T15]  (hidden comment: Resistor 10k +/-1% 0603 100 mW)
R21  100k  [RESC1608X55X25ML10T15]
R22  1M  [FP-CRGP0603-IPC_C]
R23  330 ohm  [FP-MCT0603-MFG]
R24  330 ohm  [FP-MCT0603-MFG]
R25  330 ohm  [FP-MCT0603-MFG]
R26  330 ohm  [FP-MCT0603-MFG]
R27  330 ohm  [FP-MCT0603-MFG]
R28  330 ohm  [FP-MCT0603-MFG]
R29  330 ohm  [FP-MCT0603-MFG]
U1  AP2112K-3.3TRG1  [FP-SOT25-IPC_A]
U2  MIC2026-1YM-TR  [FP-SOICN-8LD-PL-1-IPC_B]
U3  MIC2026-1YM-TR  [FP-SOICN-8LD-PL-1-IPC_B]
U4  MIC2026-1YM-TR  [FP-SOICN-8LD-PL-1-IPC_B]
U5  MIC2026-1YM-TR  [FP-SOICN-8LD-PL-1-IPC_B]
Y1  ABL-24.000MHZ-B2  [XTAL_HC49P488W46L1150T500H350]

### Blocks framed on the sheet
Decoupling Capacitors: C9-C21

### Ports
DN1.D+ (in, see InterfaceBoard[4C]), DN1.D- (in, see InterfaceBoard[4C]), DN1.VBUS (out, see InterfaceBoard[4C]), DN2.D+ (in, see InterfaceBoard[4C]), DN2.D- (in, see InterfaceBoard[4C]), DN2.VBUS (out, see InterfaceBoard[4C]), DN3.D+ (in, see InterfaceBoard[5C]), DN3.D- (in, see InterfaceBoard[5C]), DN3.VBUS (out, see InterfaceBoard[5B]), DN4.D+ (in, see InterfaceBoard[5A]), DN4.D- (in, see InterfaceBoard[5A]), DN4.VBUS (out, see InterfaceBoard[5A]), DN5.D+ (in, see InterfaceBoard[5C]), DN5.D- (in, see InterfaceBoard[5C]), DN5.VBUS (out, see InterfaceBoard[5C]), DN6.D+ (in, see InterfaceBoard[5B]), DN6.D- (in, see InterfaceBoard[5B]), DN6.VBUS (out, see InterfaceBoard[5B]), DN7.D+ (in, see InterfaceBoard[4C]), DN7.D- (in, see InterfaceBoard[4C]), DN7.VBUS (out, see InterfaceBoard[4C]), UP.D+ (in, see InterfaceBoard[4B]), UP.D- (in, see InterfaceBoard[4B]), UP.VBUS (in, see InterfaceBoard[4B])

### Nets
+5: C5.1 R13.1 U1.1(VIN) U2.7(IN) U3.7(IN) U4.7(IN) U5.7(IN)  [project net 5V]
GND: C5.2 C6.1 C7.2 C8.2 C9.2 C10.2 C11.2 C12.2 C13.1 C14.1 C15.1 C16.2 C17.1 C18.1 C19.1 C20.1 C21.1 C22.1 C23.1 C24.1(C) C25.1(C) C26.1(C) C27.1(C) C28.1(C) C29.1(C) C30.1(C) D9.1(C) D11.2(K) D12.2(K) D13.2(K) D14.2(K) D15.2(K) D16.2(K) DX.2(K) IC1.19(TEST) IC1.65(GROUND) R14.2 R16.1 R21.2 U1.2(GND) U2.6(GND) U3.6(GND) U4.6(GND) U5.6(GND)
3.3V: C7.1 C9.1 C10.1 C13.2 C16.1 C17.2 C18.2 C19.2 C20.2 C21.2 IC1.5(VDDA33) IC1.10(VDDA33) IC1.52(VDDA33) IC1.57(VDDA33) IC1.64(VDD33PLL) R5.1 R6.1 R7.1 R8.1 R9.1 R10.1 R11.1 R12.1 R17.1 R18.2 R20.2 U1.5(VOUT)  [also labelled VDD33IO, VDD33REG]
CFG_SEL0: IC1.41(SCL/SMBCLK/CFG_SEL0) R18.1
CFG_SEL1: IC1.42(HS_IND/CFG_SEL1) R19.1
CFG_SEL2: IC1.13(CFG_SEL2) R20.1
DN1.D+: IC1.2(USBDN1_DP/PRT_DIS_P1) ; port DN1.D+
DN1.D-: IC1.1(USBDN1_DM/PRT_DIS_M1) ; port DN1.D-
DN1.VBUS: C27.2(A) R26.1 U2.8(OUTA) ; port DN1.VBUS
DN2.D+: IC1.4(USBDN2_DP/PRT_DIS_P2) ; port DN2.D+
DN2.D-: IC1.3(USBDN2_DM/PRT_DIS_M2) ; port DN2.D-
DN2.VBUS: C24.2(A) R23.1 U2.5(OUTB) ; port DN2.VBUS
DN3.D-: IC1.55(USBDN7_DM/PRT_DIS_M7) IC1.56(USBDN7_DP/PRT_DIS_P7) ; port DN3.D-
DN3.VBUS: C26.2(A) R25.1 U4.5(OUTB) ; port DN3.VBUS
DN4.D+: IC1.54(USBDN6_DP/PRT_DIS_P6) ; port DN4.D+
DN4.D-: IC1.53(USBDN6_DM/PRT_DIS_M6) ; port DN4.D-
DN4.VBUS: C29.2(A) R28.1 U4.8(OUTA) ; port DN4.VBUS
DN5.D+: IC1.7(USBDN3_DP/PRT_DIS_P3) ; port DN5.D+
DN5.D-: IC1.6(USBDN3_DM/PRT_DIS_M3) ; port DN5.D-
DN5.VBUS: C28.2(A) R27.1 U3.8(OUTA) ; port DN5.VBUS
DN6.D+: IC1.9(USBDN4_DP/PRT_DIS_P4) ; port DN6.D+
DN6.D-: IC1.8(USBDN4_DM/PRT_DIS_M4) ; port DN6.D-
DN6.VBUS: C25.2(A) R24.1 U3.5(OUTB) ; port DN6.VBUS
DN7.D+: IC1.12(USBDN5_DP/PRT_DIS_P5) ; port DN7.D+
DN7.D-: IC1.11(USBDN5_DM/PRT_DIS_M5) ; port DN7.D-
DN7.VBUS: C30.2(A) R29.1 U5.8(OUTA) ; port DN7.VBUS
LEDA1: D2.1(K) IC1.51(LED_A1_N/PRT_SWP1)
LEDA2: D3.1(K) IC1.49(LED_A2_N/PRT_SWP2)
LEDA3: D4.1(K) IC1.47(LED_A3_N/PRT_SWP3)
LEDA4: D5.1(K) IC1.33(LED_A4_N/PRT_SWP4)
LEDA5: D6.1(K) IC1.31(LED_A5_N/PRT_SWP5)
LEDA6: D7.1(K) IC1.17(LED_A6_N/PRT_SWP6)
LEDA7: D8.1(K) IC1.15(LED_A7_N/PRT_SWP7)
LEDB1: D2.2(K) IC1.50(LED_B1_N/BOOST0)
LEDB2: D3.2(K) IC1.48(LED_B2_N/BOOST1)
LEDB3: D4.2(K) IC1.34(LED_B3_N/GANG_EN)
LEDB4: D5.2(K) IC1.32(LED_B4_N)
LEDB5: D6.2(K) IC1.18(LED_B5_N)
LEDB6: D7.2(K) IC1.16(LED_B6_N)
LEDB7: D8.2(K) IC1.14(LED_B7_N)
LOCAL_PWR: IC1.45(SUSP_IND/LOCAL_PWR/NON_REM0) R12.2
OCS1: IC1.28(OCS1_N) U2.2(~{FLGA})
OCS2: IC1.27(OCS2_N) U2.3(~{FLGB})
OCS3: IC1.22(OCS3_N) U3.2(~{FLGA})
OCS4: IC1.21(OCS4_N) U3.3(~{FLGB})
OCS5: IC1.35(OCS5_N) U5.2(~{FLGA})
OCS6: IC1.38(OCS6_N) U4.2(~{FLGA})
OCS7: IC1.37(OCS7_N) U4.3(~{FLGB})
PRTPWR1: IC1.29(PRTPWR1) U2.1(ENA)
PRTPWR2: IC1.26(PRTPWR2) U2.4(ENB)
PRTPWR3: IC1.23(PRTPWR3) U3.1(ENA)
PRTPWR4: IC1.20(PRTPWR4) U3.4(ENB)
PRTPWR5: IC1.30(PRTPWR5) U5.1(ENA)
PRTPWR6: IC1.39(PRTPWR6) U4.1(ENA)
PRTPWR7: IC1.36(PRTPWR7) U4.4(ENB)
RBIAS: IC1.63(RBIAS) R14.1
RESET: C8.1 IC1.43(RESET_N) R17.2
UP.D+: IC1.59(USBUP_DP) ; port UP.D+
UP.D-: IC1.58(USBUP_DM) ; port UP.D-
UP.VBUS: C6.2 R15.1 ; port UP.VBUS
VBUS_DET: IC1.44(VBUS_DET) R15.2 R16.2
VDDAPLL: C12.1 C15.2 IC1.62(VDD18PLL)
VDDCR: C11.1 C14.2 IC1.25(VDD18)
XTAL1: C22.2 IC1.61(XTAL1/CLKIN) R22.2 Y1.1
XTAL2: C23.2 IC1.60(XTAL2) R22.1 Y1.2
NetD2_3: D2.3(A) D2.4(A) R5.2
NetD3_3: D3.3(A) D3.4(A) R6.2
NetD4_3: D4.3(A) D4.4(A) R7.2
NetD5_3: D5.3(A) D5.4(A) R8.2
NetD6_3: D6.3(A) D6.4(A) R9.2
NetD7_3: D7.3(A) D7.4(A) R10.2
NetD8_3: D8.3(A) D8.4(A) R11.2
NetD9_2: D9.2(A) R19.2 R21.1
NetD11_1: D11.1(A) R24.2
NetD12_1: D12.1(A) R25.2
NetD13_1: D13.1(A) R26.2
NetD14_1: D14.1(A) R27.2
NetD15_1: D15.1(A) R28.2
NetD16_1: D16.1(A) R29.2
NetDX_1: DX.1(A) R23.2
NetR13_2: R13.2 U1.3(EN)

Not connected (* = marked no-connect by the designer): IC1 24(VDD33CR)* 40(SDA/SMBDATA/NON_REM1)* 46(VDD33)*; U1 4(NC); U5 3(~{FLGB})* 4(ENB)* 5(OUTB)*

### Notes on the sheet
- 24 MHz Crystal
- (in symbol CMP-05428-000017-2) +

### Library data of the parts
C5 C7 = CMP-001-00003-6: Chip Capacitor, 1 uF, +/- 10%, 16 V, 0603 (1608 Metric); Voltage Rating: 16V; Capacitor Type: Ceramic; Max Operating Temperature: 125°C; Pins: 2; Tolerance: 10%; Min Operating Temperature: -55°C; RoHS Compliant: True; Mounting Technology: SM; Case/Package: 0603
C6 = CMP-08246-003049-1: Multilayer Ceramic Capacitors 2.2μF ±10% 25V X5R SMD 0603; Capacitance: 2.2uF; Termination: SMD/SMT; Dielectric Material: Ceramic; REACH SVHC: No SVHC; Voltage Rating (DC): 25V; Voltage Rating: 25V; RoHS Compliant: Yes; Case Code (Imperial): 0603; Case/Package: 0603; Height: 0.8mm; Mount: Surface Mount; Min Operating Temperature: -55°C; Tolerance: 10%; Radiation Hardening: No; Dielectric: X5R; Depth: 0.8mm; Package Quantity: 4000; Length: 1.6mm; Weight: 7.1E-05oz; Resistor Type: Ceramic; Series: C; Thickness: 0.035inch; Width: 0.031inch; Case Code (Metric): 1608; Lead Free: Lead Free; Max Operating Temperature: 85°C; Packaging: Tape and Reel
C8 = CMP-2006-04474-2: General Purpose Ceramic Capacitor, 0603, 1uF, 10%, X5R, 15%, 6.3V; Insulation Resistance: 100GR; Dissipation Factor: 5%; Package Quantity: 1; Mount: Surface Mount; Series: -; Number of Pins: 2; Length: 1.6mm; RoHS Compliant: Yes; Capacitance: 1uF; Depth: 0.81mm; Case Code (Imperial): 0603; Lead Free: Lead Free; Max Operating Temperature: 85°C; Case Code (Metric): 1608; Min Operating Temperature: -55°C; Contact Plating: Tin; Voltage: 6.3V; Tolerance: 10%; Width: 0.032inch; Voltage Rating (DC): 6.3V; Voltage Rating: 6.3V; Termination: SMD/SMT; Radiation Hardening: No; Case/Package: 0603; Thickness: 0.035inch; Height: 0.9mm; REACH SVHC: No SVHC; Packaging: Tape and Reel; Construction: Flat; Dielectric: X5R
C9-C12 C17-C21 = CMP-2006-04390-1: 06035C104KAT4A; Manufacturer: AVX Interconnect / Elco; Part Number: 06035C104KAT4A
C13-C16 = CMP-2000-07531-4: Ceramic Capacitor General Use 1uF ±10% 50V X7R 0603 / UMK107AB7105KA-T; Series: M; Width: 0.031inch; Mount: Surface Mount; Radiation Hardening: No; Voltage Rating (DC): 50V; Packaging: Tape and Reel; Termination: SMD/SMT; Depth: 0.8mm; Case Code (Metric): 1608; Case Code (Imperial): 0603; Height: 0.8mm; Voltage Rating: 50V; Package Quantity: 1; Halogen Free: Halogen Free; Dielectric: X7R; Min Operating Temperature: -55°C; Length: 1.6mm; Construction: Flat; Tolerance: 10%; Thickness: 0.037inch; Max Operating Temperature: 125°C; Case/Package: 0603; Capacitance: 1uF; RoHS Compliant: Yes
C22 C23 = CMP-03913-65419545-2: Ceramic Capacitor 33pF, 16VDC, 0603, ±5 %; Voltage Rating: 16V; Tolerance: 5%; Insulation Resistance: 10GΩ; Thickness: 863.6µm; Height: 800µm; Width: 800µm; Case Code (Imperial): 0603; Case Code (Metric): 1608; Case/Package: 0603; Mount: Surface Mount; Min Operating Temperature: -55°C; RoHS: Compliant; Packaging: Cut Tape; Capacitance: 33pF; Max Operating Temperature: 125°C; Length: 1.6mm; Voltage Rating (DC): 16V
C24-C30 = CMP-05428-000017-2: Conductive Polymer Aluminum Solid Capacitors (OS-CON) 150uF ±20% 6.3V; Ripple Current: 3.52A; Leakage Current: 500uA; ESR (Equivalent Series Resistance): 12mR; Polarity: Polar; Dissipation Factor: 12%; Life (Hours): 2000Hour; Number of Pins: 6; Voltage Rating (DC): 6.3V; Lead Free: Lead Free; Height: 5.9mm; Case/Package: Radial; Package Quantity: 1500; Length: 5.9mm; Tolerance: 20%; Voltage: 6.3V; REACH SVHC: No SVHC; Mount: Surface Mount; Min Operating Temperature: -55°C; Ripple Current (AC): 3.52A; Packaging: Tape and Reel; Series: OS-CON™, SVPE; Max Operating Temperature: 105°C; Diameter: 5mm; Voltage Rating: 6.3V; Capacitance: 150uF; RoHS Compliant: Yes; Termination: SMD/SMT; Height - Seated (Max): 0.236inch
D2-D8 = CMP-03913-90235601-1: 156125YV73000 Dual Color LED, Yellow/bright Green, Water Clear, 1.2mm; Forward Voltage: 2V; Luminous Intensity: 50mcd; Viewing Angle: 120°; Forward Current: 40mA; Max Reverse Voltage (DC): 5V; Peak Wavelength: 573nm; Dominant Wavelength: 571nm; NexarPartId: 90235601; Length: 3.2mm; Packaging: Tape and Reel; RoHS: Compliant; Width: 1.2mm; Min Operating Temperature: -40°C; Max Operating Temperature: 85°C; Height: 800µm
D9 = CMP-57192-000009-1: LED RED DIFFUSED SMD; Test Current: 20mA; Forward Voltage: 2V; Approvals: UL; Dominant Wavelength: 636nm; Viewing Angle: 140°; Lens Color: White; Luminous Intensity: 60mcd; Power Rating: 50mW; Number of LEDs: 1; Color: Red; Forward Current: 20mA; Moisture Sensitivity Level: 2; Case Code (Imperial): 0603; Lead Free: Lead Free; Lens Transparency: Diffused; Case Code (Metric): 1608; Height: 0.6mm; Max Operating Temperature: 85°C; Width: 0.8mm; Lens Style: Diffused; Illumination Color: Red; Wavelength: 636nm; REACH SVHC: No SVHC; Package Quantity: 1; RoHS Compliant: Yes; Case/Package: 0603; Number of Pins: 2; Packaging: Tape and Reel; Length: 1.6mm; Mount: Surface Mount; Min Operating Temperature: -25°C
D11-D16 DX = CMP-007-00024-2: as D17 on sheet BNO055; Manufacturer URL: http://www.us.liteon.com/; Case/Package: 0603; Datasheet Version: Rev. F, 05/2013; Package Reference: C191KRKT; Datasheet URL: http://optoelectronics.liteon.com/upload/download/DS-22-99-0151/S_110_LTST-C190KRKT.pdf; Package Description: 2-Pin Surface Mount Device, Body 1.6 x 0.8 mm; Nominal Vf: 2V; Packaging: TapeandReel; RoHS Compliant: True; Pins: 2; Illumination Colour: Red; Colour: Red; Mounting Technology: SM; Package Quantity: 3000; Min Operating Temperature: -55°C; Max Operating Temperature: 85°C
IC1 = CMP-0186-00330-1: USB 2.0 Hi-Speed 7-Port Hub Controller, 3 to 3.6 V, 0 to 70 degC, 64-Pin QFN, RoHS, Tape and Reel; Manufacturer: Microchip; USB Speed: High Speed; MultiTRAK Tech: TRUE; Packing: TRAY; MGMT I/F: I2C; Op Voltage: 3.3 V; Upstream Port: USB 2.0; Voltage Regulator: 1.8 V; Downstream Ports: 7; ComponentLink1URL: http://www.microchip.com/; Mounting Technology: Surface Mount; ROHS: TRUE; ComponentLink3URL: http://ww1.microchip.com/downloads/en/DeviceDoc/2517.pdf; DatasheetVersion: Rev. 2.8; ComponentLink2URL: http://ww1.microchip.com/downloads/en/DeviceDoc/2517.pdf; PackageReference: QFN-64; Operating Temperature: 0 to 70 degC; PackageDescription: 64-Pin Plastic Quad Flat No Lead Package, Body 9 x 9 mm, Pitch 0.5 mm; PartNumber: USB2517-JZX; ComponentLink2Description: Datasheet; ComponentLink3Description: Package Specification; ComponentLink1Description: Manufacturer URL
R5-R11 R19 = CMP-03211-002147-1: CRGCQ 0603 330R 5%; Manufacturer: TE Connectivity; Manufacturer Part Number: CRGCQ0603J330R; Temperature Coefficient: ±100ppm/°C; Power Rating: 0.1W; Value: 330Ω; Voltage Rating: 75V; Tolerance: 0.05; Device Class L1: Passive Components; ComponentLink2URL: https://www.te.com/commerce/DocumentDelivery/DDEController?Action=showdoc&DocId=Data+Sheet%7F1773204-3%7F1%7Fpdf%7FEnglish%7FENG_DS_1773204-3_1.pdf%7F4-2176339-581; ComponentLink2Description: Datasheet; RoHS: TRUE; Category: Res; Digikey Description: CRGCQ 0603 330R 5%; Lead Free: Yes; Octopart: https://octopart.com/crgcq0603j330r-te+connectivity-91018118; Mouser Description: Res General Purpose Thick Film 0603 330 Ohm 5% 1/10W ±100ppm/°C Molded Paper T/R; Height: 0.55mm; Composition: Thick Film; Series: CRGCQ; Package: CRGCQ0603; Device Class L3: Chip SMD Resistors; Resistance: 330Ω; Ambient Temperature Range High: +70°C; Temperature: -55°C to +155°C; Device Class L2: Resistors; Ipc Land Pattern Name: RESC16080X45; Temperature Range High: +155°C; Temperature Range Low: -55°C
R12 R18 R20 = CMP-009-00017-5: Chip Resistor, 10 KOhm, +/- 1%, 01 W, -55 to 155 degC, 0603 (1608 Metric); Voltage Rating: 50V; Power: 100mW; RoHS Compliant: True; Min Operating Temperature: -55°C; Pins: 2; Case/Package: 0603; Mounting Technology: SM; Max Operating Temperature: 155°C; Tolerance: 1%
R13 = CMP-03412-038630-1: RES 1MΩ 1.00% 0.1W 0603; Resistance: 1MR; Tolerance: 1%; Case/Package: 0603; RoHS Compliant: Yes
R14 = CMP-2000-04198-1: Manufacturer: Yageo; Part Number: RC0603FR-1312KL
R15 R16 R21 = CMP-009-00023-5: as R33 on sheet Manual Override; Max Operating Temperature: 155°C; RoHS Compliant: True; Tolerance: 1%; Pins: 2; Case/Package: 0603; Mounting Technology: SM; Min Operating Temperature: -55°C
  R21: Value: 100k
R17 = CMP-03211-009884-1: CRGCQ 0603 10K 5%; Manufacturer Part Number: CRGCQ0603J10K; Manufacturer: TE Connectivity; Tolerance: 0.05; Power Rating: 0.1W; Resistance: 10KΩ; Voltage Rating: 75V; Value: 10KΩ; Temperature Coefficient: ±100ppm/°C; Composition: Thick Film; ComponentLink2URL: https://www.te.com/commerce/DocumentDelivery/DDEController?Action=showdoc&DocId=Data+Sheet%7F1773204-3%7F1%7Fpdf%7FEnglish%7FENG_DS_1773204-3_1.pdf%7F4-2176339-923; Device Class L1: Passive Components; Package: CRGCQ0603; Mouser Description: Res Thick Film 0603 10K Ohm 5% 0.1W(1/10W) ±100ppm/C Pad SMD Automotive T/R; Temperature Range High: +155°C; Category: Res; Device Class L2: Resistors; Height: 0.55mm; RoHS: TRUE; Lead Free: Yes; Ipc Land Pattern Name: RESC16080X45; Temperature: -55°C to +155°C; Series: CRGCQ; Digikey Description: CRGCQ 0603 10K 5%; Octopart: https://octopart.com/crgcq0603j10k-te+connectivity-91018097; Device Class L3: Chip SMD Resistors; Ambient Temperature Range High: +70°C; ComponentLink2Description: Datasheet; Temperature Range Low: -55°C
R22 = CMP-03211-004384-3: RES 1M OHM 1% 1/4W 0603; Resistance: 1MR; Max Power Dissipation: 250mW; Temperature Coefficient: 100ppm/°C; Case Code (Imperial): 0603; Min Operating Temperature: -55°C; Max Operating Temperature: 155°C; RoHS Compliant: Yes; Packaging: Cut Tape; Case/Package: 0603; Tolerance: 1%; Resistor Type: Thick Film; Case Code (Metric): 1608; Number of Terminations: 2
R23-R29 = CMP-02407-004102-1: RES SMD 100 OHM 1% 1/8W 0603; Temperature Coefficient: 25ppm/°C; Power Rating: 100mW; Resistance: 330R; Tolerance: 0.5%; Military Standard: Not; Case/Package: 0603; Height: 0.45mm; Max Operating Temperature: 125°C; Radiation Hardening: No; Composition: Thin Film; Mount: Surface Mount; Packaging: Tape and Reel; Length: 1.55mm; Depth: 0.85mm; Min Operating Temperature: -55°C; Lead Free: Lead Free; Contact Plating: Tin
U1 = CMP-12756-000035-1: IC REG LINEAR 3.3V 600MA SOT25; Number of Regulators: 1; Output Type: Fixed; Polarity: Positive; Min Input Voltage: 2.5V; Max Input Voltage: 6V; Accuracy: 1.5%; Quiescent Current: 55uA; Dropout Voltage: 250mV; Min Operating Temperature: -40°C; Length: 3.1mm; Output Current: 600mA; Max Operating Temperature: 85°C; Package Quantity: 1; Output Voltage: 3.3V; Width: 1.7mm; Number of Outputs: 1; Packaging: Tape and Reel; Height: 1.3mm; Lead Free: Lead Free; Max Output Current: 600mA; Case/Package: SOT-23-5; Mount: Surface Mount; Number of Pins: 5
U2-U5 = CMP-06317-000004-1: IC PWR SWITCH N-CHAN 1:2 8SOIC; On-State Resistance: 90mR; Fault Protection: Over Temperature; Interface: On/Off; Max Output Current: 500mA; Number of Outputs: 2; Output Configuration: High Side; Max Operating Temperature: 85°C; Case/Package: SOIC; Packaging: Cut Tape; Lead Free: Lead Free; REACH SVHC: No SVHC; Min Operating Temperature: -40°C; Number of Pins: 8
Y1 = ABL-24.000MHZ-B2: No Description Available; Manufacturer_Name: Abracon; Copyright: Copyright (C) 2025 Ultra Librarian. All rights reserved.; Manufacturer_Part_Number: ABL-24.000MHZ-B2

## Sheet 5V Regulator.SchDoc
size A; SheetNumber: 11; SheetTotal: 11
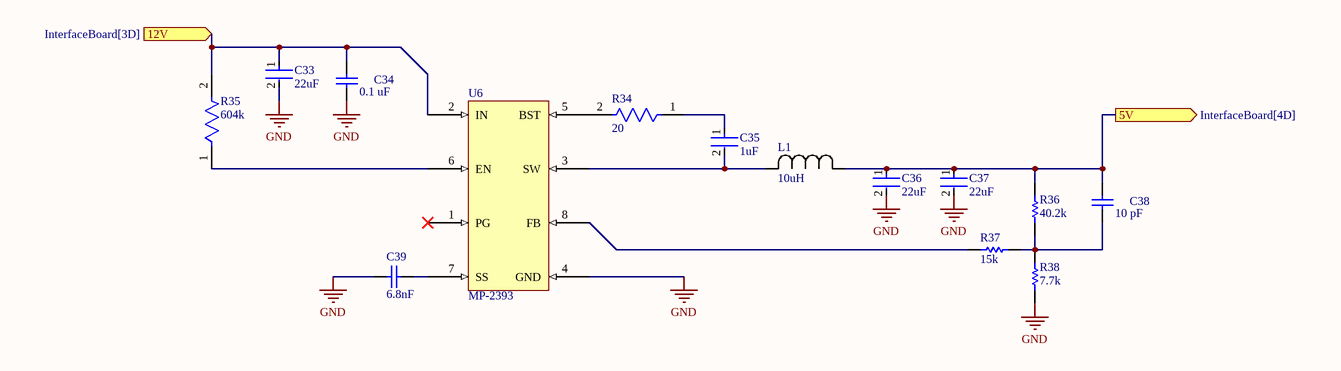
[diagram p8: 5V Regulator.SchDoc]

### Parts
C33  22uF  [FP-0603-L_1_6_0_2-W_0_8_0-IPC_B]
C34  0.1 uF  [CAPC1608X90X35NL15T15]
C35  1uF  [FP-0603-L_1_6_0_15-W_0_8-IPC_B]
C36  22uF  [FP-0603-L_1_6_0_2-W_0_8_0-IPC_B]
C37  22uF  [FP-0603-L_1_6_0_2-W_0_8_0-IPC_B]
C38  10 pF  [CAPC1608X90X35NL15T15]
C39  6.8nF  [CAPC1608X90X35NL15T15]
L1  10uH  [IND_TAIYO_NR8040_TAY]
R34  20  [FP-RT0603-MFG]
R35  604k  [FP-RT0603-MFG]
R36  40.2k  [RESC1609X55X30ML10T20]
R37  15k  [RESC1609X55X30ML10T20]
R38  7.7k  [RESC1609X55X30ML10T20]
U6  MP-2393  [MP-2393]

### Ports
5V (out, see InterfaceBoard[4D]), 12V (in, see InterfaceBoard[3D])

### Nets
12V: C33.1 C34.2 R35.2 U6.2(IN) ; port 12V
GND: C33.2 C34.1 C36.2 C37.2 C39.1 R38.1 U6.4(GND)
NetC35_1: C35.1 R34.1
NetC35_2: C35.2 L1.2 U6.3(SW)
NetC36_1: C36.1 C37.1 C38.2 L1.1 R36.2 ; port 5V
NetC38_1: C38.1 R36.1 R37.2 R38.2
NetC39_2: C39.2 U6.7(SS)
NetR34_2: R34.2 U6.5(BST)
NetR35_1: R35.1 U6.6(EN)
NetR37_1: R37.1 U6.8(FB)

Not connected (* = marked no-connect by the designer): U6 1(PG)*

### Notes on the sheet
- I estimated ~1.5A roughly for the 5V output (very approximate). The current ripple with 10uH is then about 0.45A. If the current needed is in reality less, then the ripple could be too large in comparison. Also, output current needs to be less than inductor sat current

### Library data of the parts
C33 C36 C37 = CMP-14477-000010-3: 0603; Voltage Rating: 10V; Tolerance: 20%; Case Code (Metric): 1608; Max Operating Temperature: 85°C; Min Operating Temperature: -55°C; RoHS Compliant: Yes; Case Code (Imperial): 0603; Mount: Surface Mount; Case/Package: 0603; Packaging: Cut Tape; Capacitance: 22uF
C34 C38 C39 = CMP-2006-02157-1: 0603 (1608 metric); Manufacturer: AVX Interconnect / Elco; Part Number: LD033C104KAB2A
C35 = CMP-14477-003841-2: None; Voltage Rating: 25V; Tolerance: 20%; Thickness: 0.037inch; RoHS Compliant: Yes; Mount: Surface Mount; Capacitance: 1uF; Length: 0.063inch; Case/Package: 0603; Max Operating Temperature: 125°C; Packaging: Tape and Reel; Width: 0.031inch; Ratings: AEC-Q200; Min Operating Temperature: -55°C
L1 = NR8040T100M: No Description Available; Manufacturer_Name: TAIYO YUDEN; Copyright: Copyright (C) 2025 Ultra Librarian. All rights reserved.; Manufacturer_Part_Number: NR8040T100M
R34 R35 = CMP-03412-028997-1: RES SMD 604K OHM 1% 1/10W 0603; Manufacturer Part Number: RT0603FRE07604KL; Manufacturer: Yageo; Power Rating: 0.1W; Temperature Coefficient: 50 ppm/°C; Voltage Rating: 75V; Tolerance: 0.01; Value: 604KΩ; Series: RT; Temperature Range High: +155°C; RoHS: TRUE; Ipc Land Pattern Name: RESC16080X45; Footprint Url: http://www.yageo.com/exep/pages/download/literatures/PYu-R_Mount_10.pdf; ComponentLink2Description: Datasheet; Device Class L3: Chip SMD Resistors; Digikey Description: RES SMD 604K OHM 1% 1/10W 0603; Device Class L1: Passive Components; ComponentLink2URL: http://www.yageo.com/documents/recent/PYu-RT_1-to-0.01_RoHS_L_9.pdf; Temperature Range Low: -55°C; Category: Res; Lead Free: Yes; Package: RT0603; Octopart: https://octopart.com/rt0603fre07604kl-yageo-26041741; Automotive: No; Composition: Thin Film; Height: 0.55mm; Temperature: -55°C to +155°C; Mouser Description: High Precision-High Stability Chip Resistor Thin Film 0603 604kOhm 1% Paper T/R; Resistance: 604KΩ; Device Class L2: Resistors
R36-R38 = CMP-2000-03706-1: 0603; Manufacturer: Vishay Dale; Part Number: TNPW060313K3BEEA
U6 = MP-2393: https://www.monolithicpower.com/en/documentview/productdocument/index/version/2/document_type/Datasheet/lang/en/sku/MP2393GTL-Z/document_id/4270/